# Altium project MSM8916_DRAM_PMIC_REF.PrjPcb (part 2 of 4)

## Sheet 10 MSM8916_POWER1.SchDoc
size 871 x 576 mm
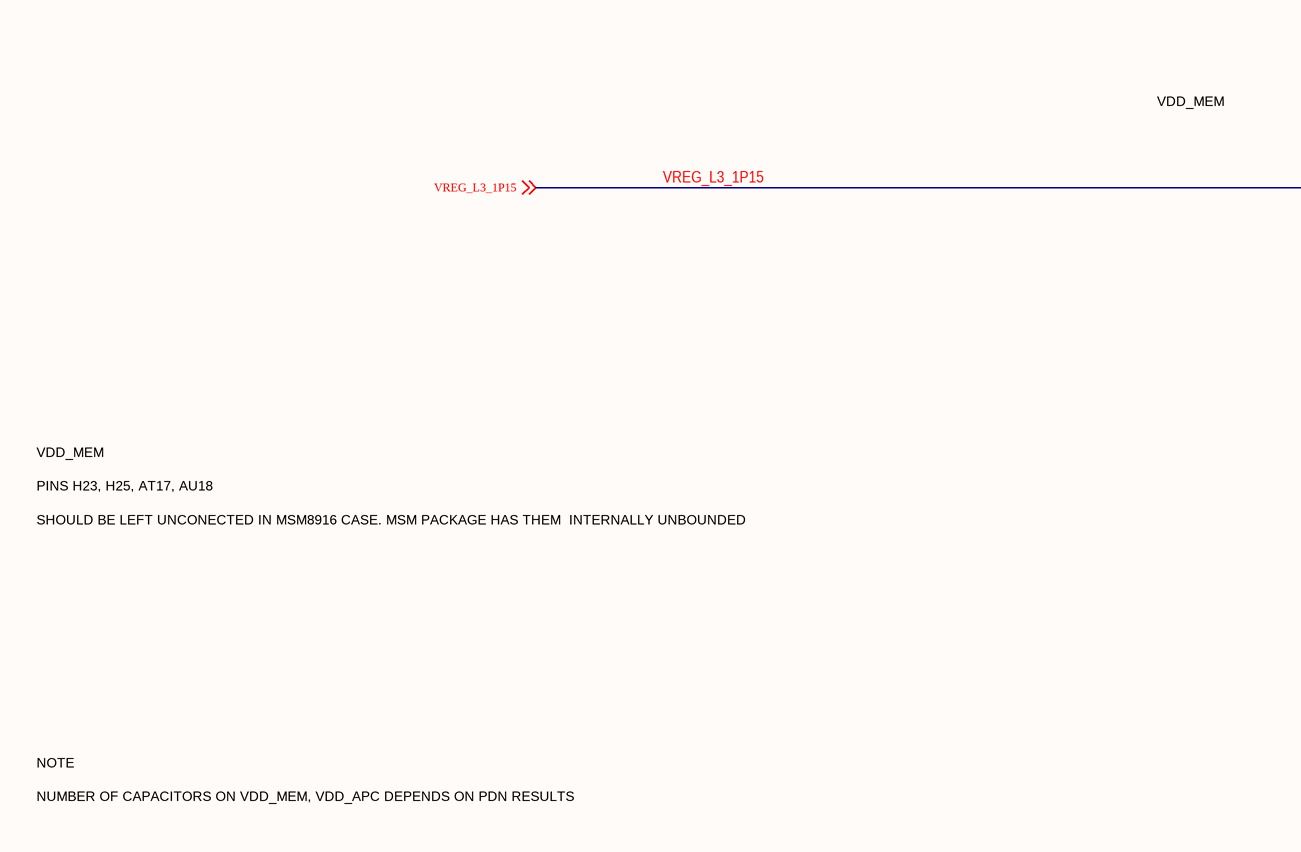
[diagram p21: 10 MSM8916_POWER1.SchDoc, top left]
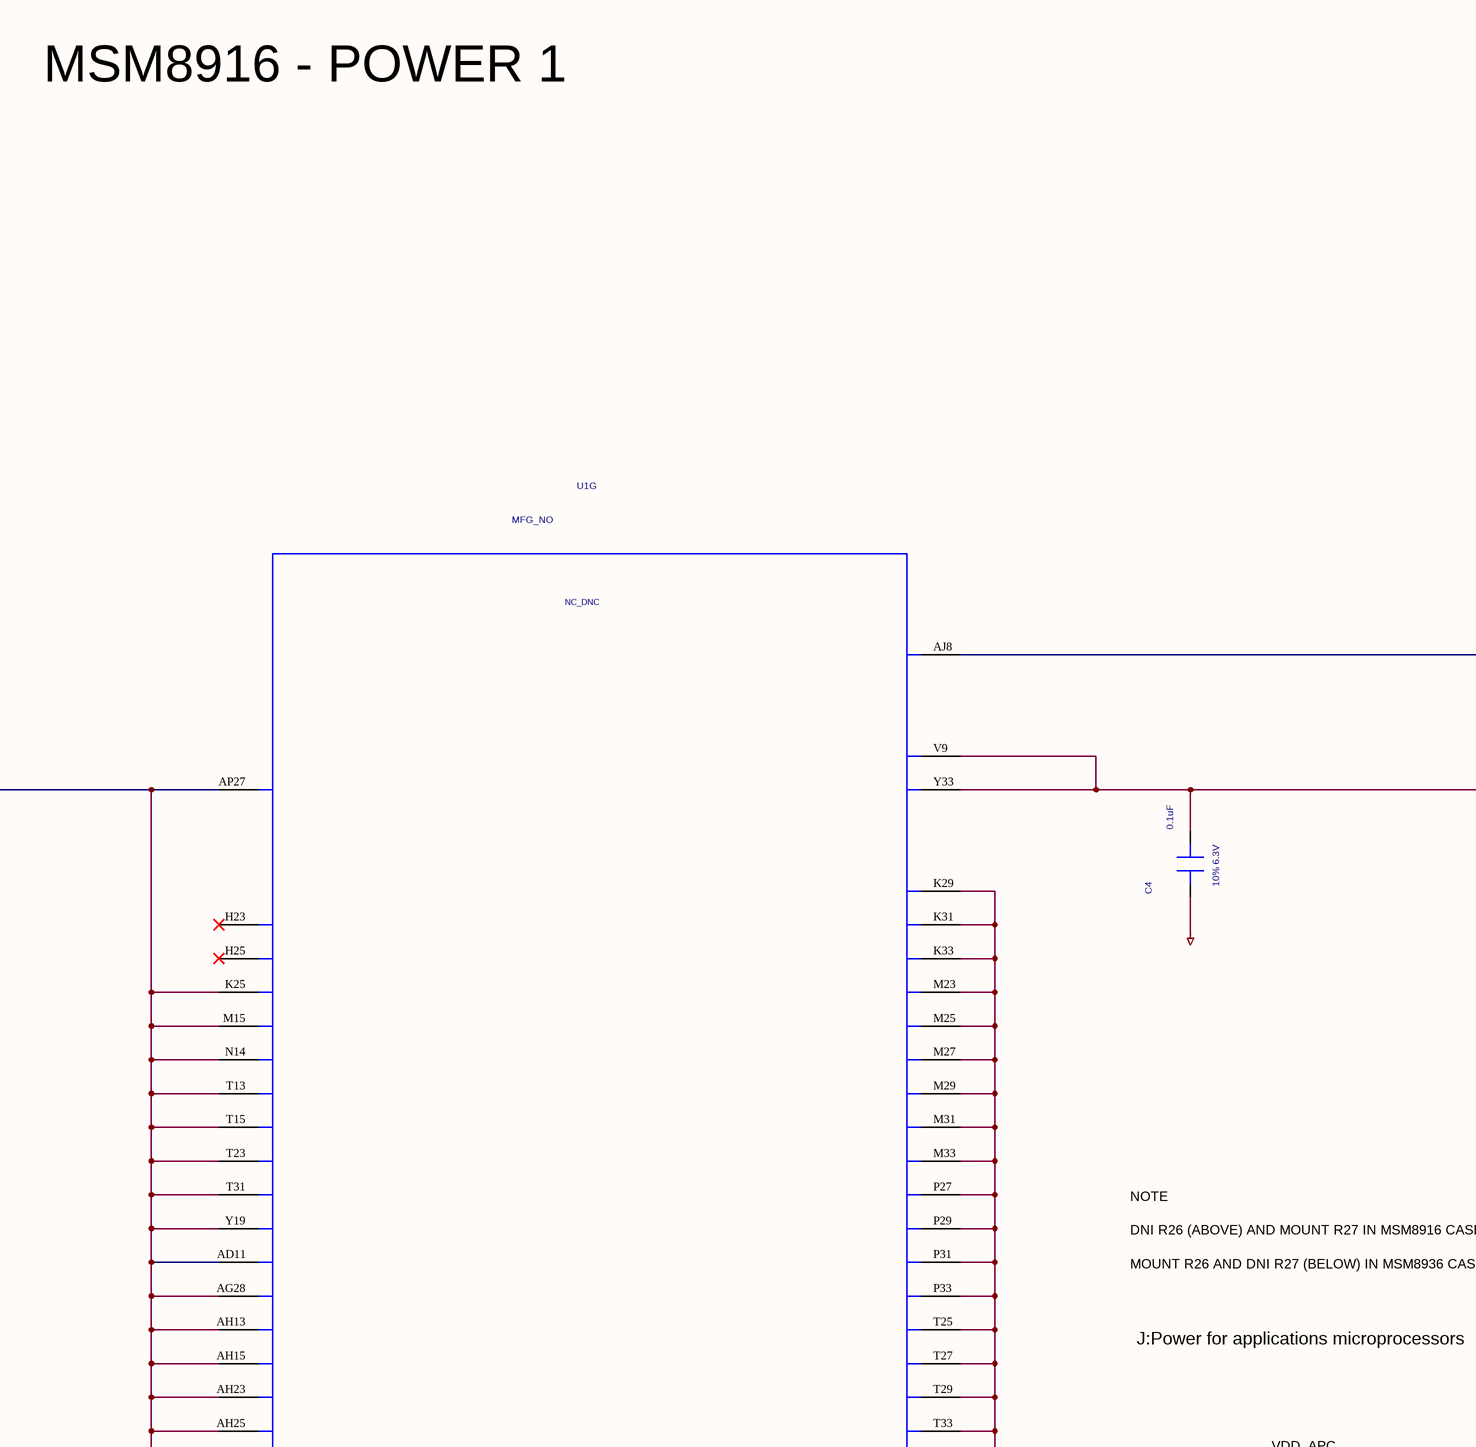
[diagram p22: 10 MSM8916_POWER1.SchDoc, top middle]
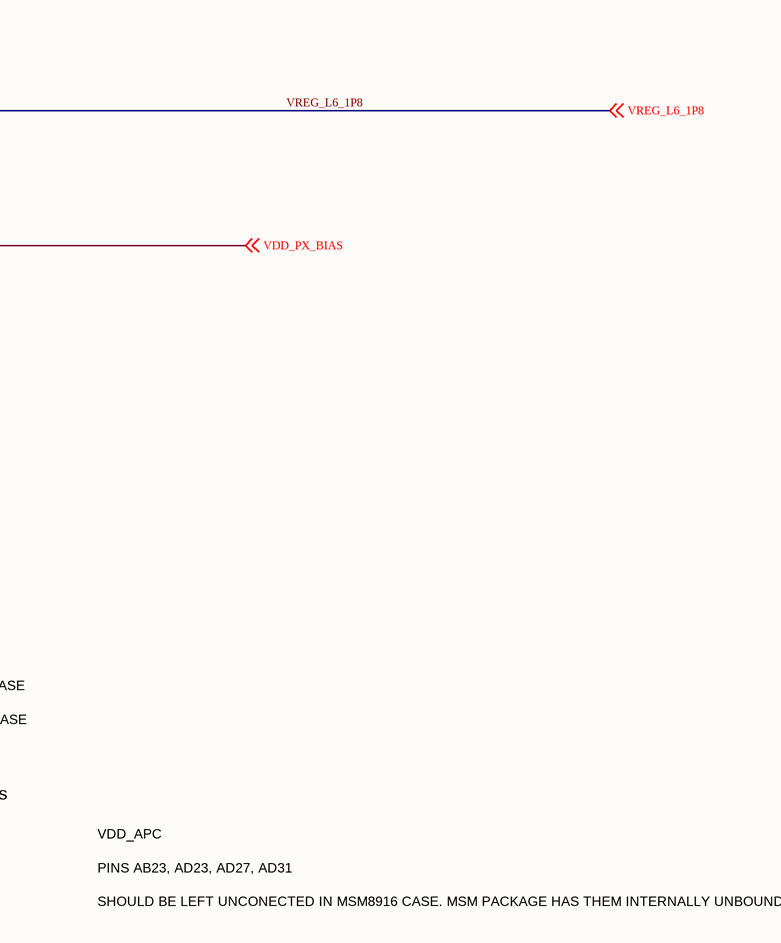
[diagram p23: 10 MSM8916_POWER1.SchDoc, top right]
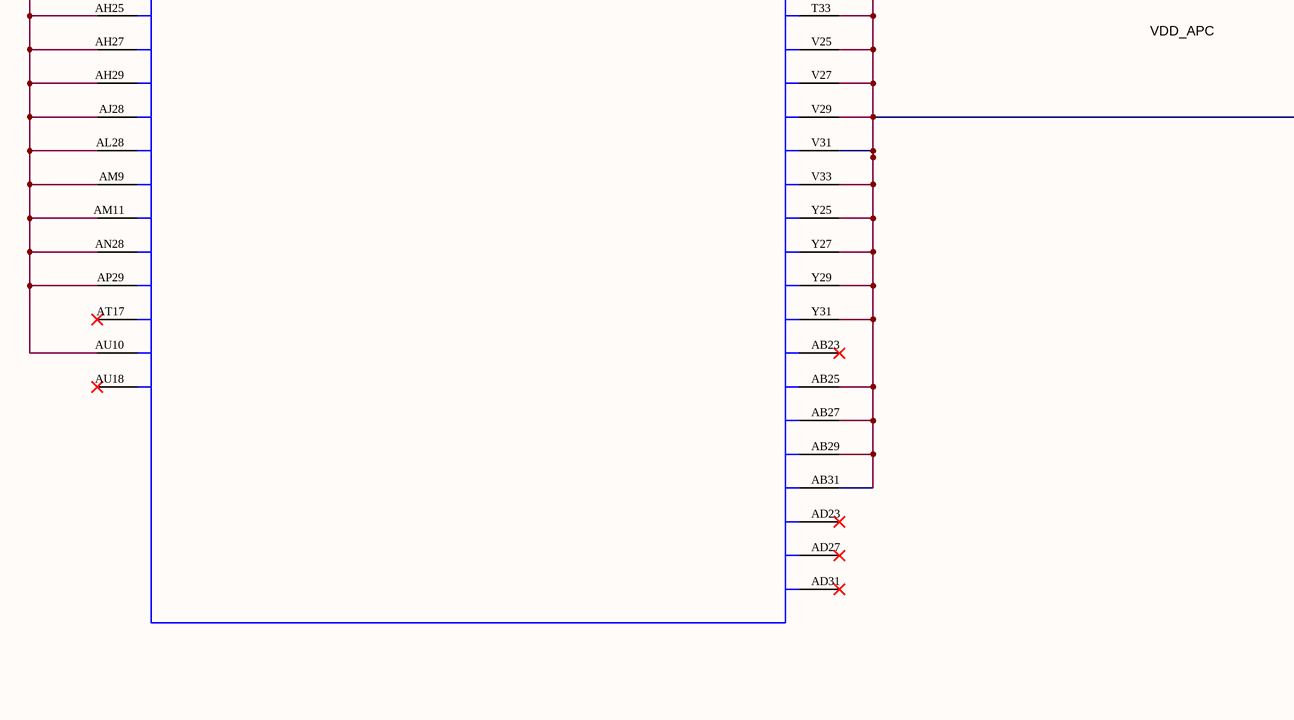
[diagram p24: 10 MSM8916_POWER1.SchDoc, bottom middle]
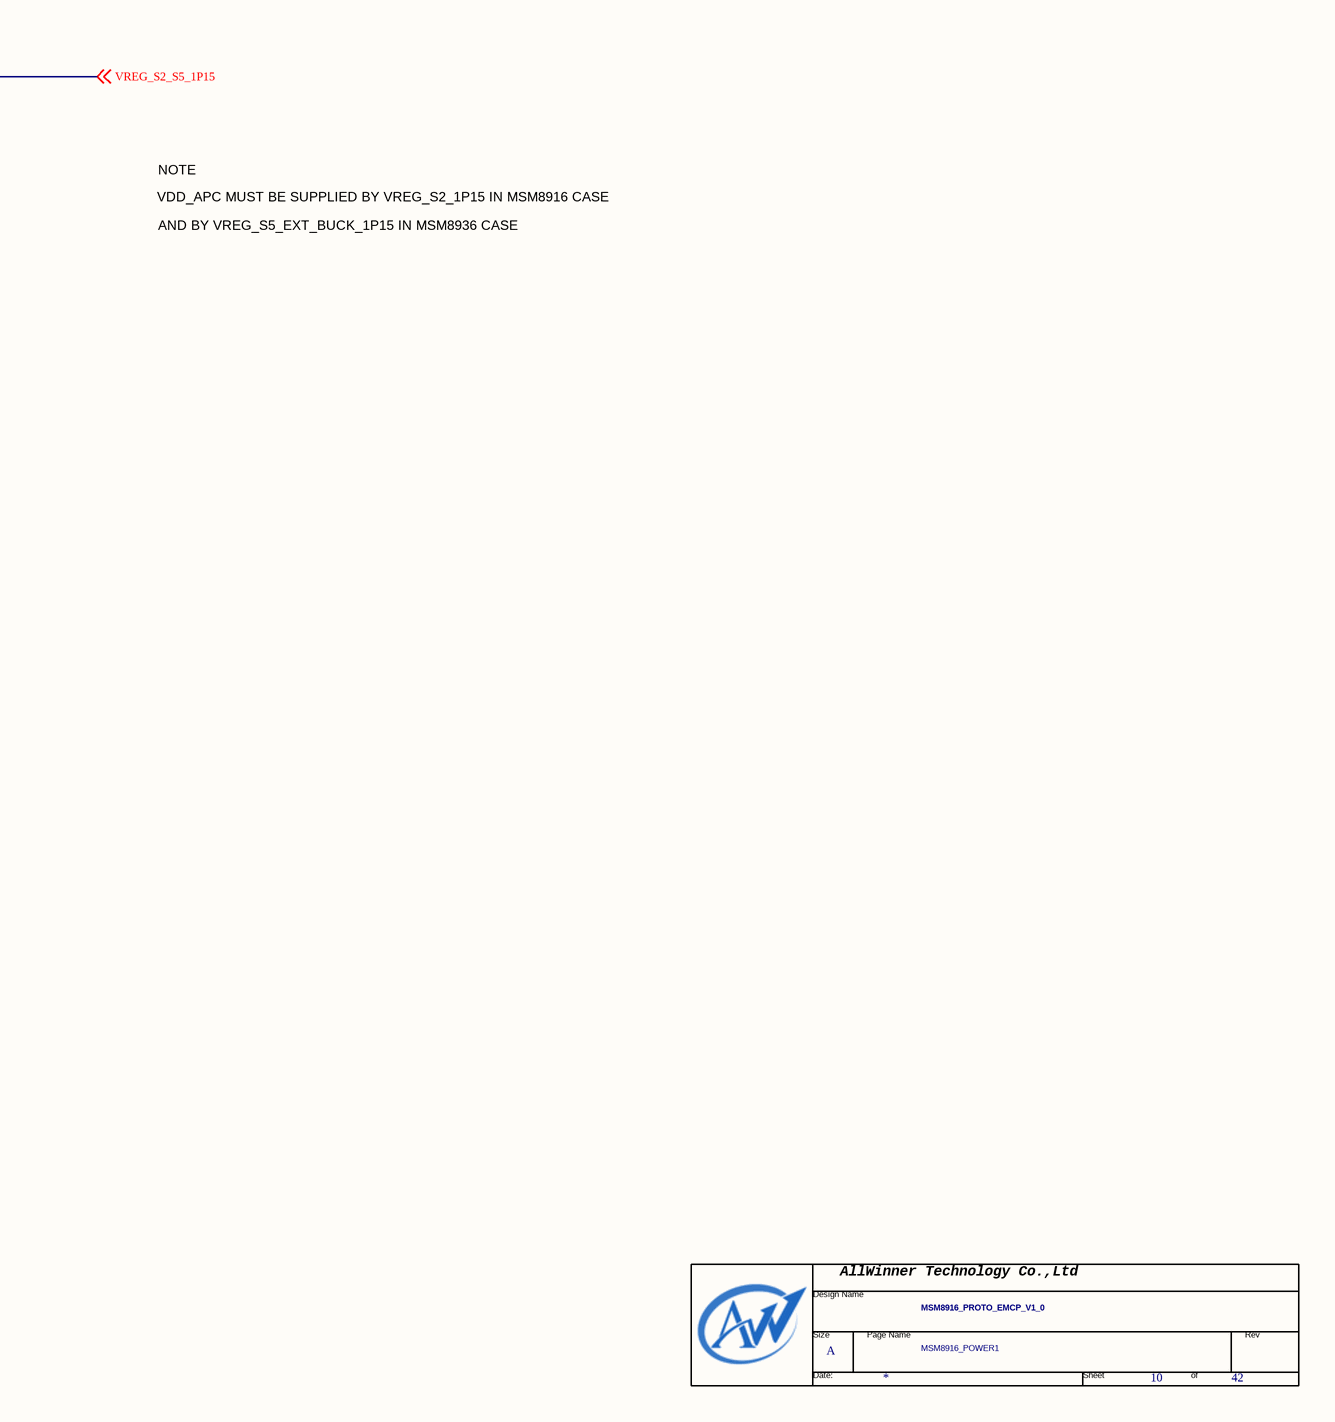
[diagram p25: 10 MSM8916_POWER1.SchDoc, bottom right]

### Parts
(Parts that share a designator on the sheet are numbered #1, #2 ... from top to bottom, then left to right.)
*#4  Page Count: 42  Page Number: 10  Page Size: A  Title: MSM8916_PROTO_EMCP_V1_0  Doc: MSM8916_POWER1  (hidden comment: TitleBlock0-AW)  (graphical)
C4  0.1uF  Tolerance: 10% 6.3V  [c0402]
U1  SYMNAME: NC_DNC  PART_ID: MFG_NO  [MSM-8916-0-760NSP-TR-00-0]  (hidden comment: ASIC_MSM8936_760PIN)  (part G of 13)

### Nets
DGND: C4.1(POS)
VREG_L6_1P8: U1.AJ8(QFPROM_BLOW_VDD) ; off-sheet VREG_L6_1P8
VDD_PX_BIAS: C4.2(NEG) U1.V9(VDDPX_VBIAS_SDC) U1.Y33(VDDPX_VBIAS_UIM) ; off-sheet VDD_PX_BIAS
VREG_L3_1P15: U1.AD11(VDDMX_1_11) U1.AG28(VDDMX_1_12) U1.AH13(VDDMX_1_13) U1.AH15(VDDMX_1_14) U1.AH23(VDDMX_1_15) U1.AH25(VDDMX_1_16) U1.AH27(VDDMX_1_17) U1.AH29(VDDMX_1_18) U1.AJ28(VDDMX_1_19) U1.AL28(VDDMX_1_20) U1.AM9(VDDMX_1_21) U1.AM11(VDDMX_1_22) U1.AN28(VDDMX_1_23) U1.AP27(VDDMX_TXDAC) U1.AP29(VDDMX_1_24) U1.AU10(VDDMX_1_26) U1.K25(VDDMX_1_3) U1.M15(VDDMX_1_4) U1.N14(VDDMX_1_5) U1.T13(VDDMX_1_6) U1.T15(VDDMX_1_7) U1.T23(VDDMX_1_8) U1.T31(VDDMX_1_9) U1.Y19(VDDMX_1_10) ; off-sheet VREG_L3_1P15
VREG_S2_S5_1P15: U1.AB25(VDD_APC_28) U1.AB27(VDD_APC_29) U1.AB29(VDD_APC_30) U1.AB31(VDD_APC_31) U1.K29(VDD_APC_1) U1.K31(VDD_APC_2) U1.K33(VDD_APC_3) U1.M23(VDD_APC_4) U1.M25(VDD_APC_5) U1.M27(VDD_APC_6) U1.M29(VDD_APC_7) U1.M31(VDD_APC_8) U1.M33(VDD_APC_9) U1.P27(VDD_APC_10) U1.P29(VDD_APC_11) U1.P31(VDD_APC_12) U1.P33(VDD_APC_13) U1.T25(VDD_APC_14) U1.T27(VDD_APC_15) U1.T29(VDD_APC_16) U1.T33(VDD_APC_17) U1.V25(VDD_APC_18) U1.V27(VDD_APC_19) U1.V29(VDD_APC_20) U1.V31(VDD_APC_21) U1.V33(VDD_APC_22) U1.Y25(VDD_APC_23) U1.Y27(VDD_APC_24) U1.Y29(VDD_APC_25) U1.Y31(VDD_APC_26) ; off-sheet VREG_S2_S5_1P15

Not connected (* = marked no-connect by the designer): U1 AB23(VDD_APC_27)* AD23(VDD_APC_32)* AD27(VDD_APC_33)* AD31(VDD_APC_34)* AT17(VDDMX_1_25)* AU18(VDDMX_1_27)* H23(VDDMX_1_1)* H25(VDDMX_1_2)*

### Notes on the sheet
- MSM8916 - POWER 1
- VDD_MEM
- SHOULD BE LEFT UNCONECTED IN MSM8916 CASE. MSM PACKAGE HAS THEM  INTERNALLY UNBOUNDED
- PINS H23, H25, AT17, AU18
- DNI R26 (ABOVE) AND MOUNT R27 IN MSM8916 CASE
- NOTE
- MOUNT R26 AND DNI R27 (BELOW) IN MSM8936 CASE
- J:Power for applications microprocessors
- VDD_APC
- NUMBER OF CAPACITORS ON VDD_MEM, VDD_APC DEPENDS ON PDN RESULTS
- SHOULD BE LEFT UNCONECTED IN MSM8916 CASE. MSM PACKAGE HAS THEM INTERNALLY UNBOUNDED
- PINS AB23, AD23, AD27, AD31
- VDD_APC MUST BE SUPPLIED BY VREG_S2_1P15 IN MSM8916 CASE
- AND BY VREG_S5_EXT_BUCK_1P15 IN MSM8936 CASE
- (in symbol TitleBlock0-AW) AllWinner Technology Co.,Ltd; Design Name; Size; Page Name; Rev; Date:; Sheet; of

### Library data of the parts
C4 = CAP#1: PART_NUMBER: MCN_NO; PART_ID: MFG_NO; OriginalSymbolOrigin: (-75,50); VOLT: ?V; SYMNAME: CAP; CDS_LMAN_SYM_OUTLINE: -25,50,25,-50; PACK_TYPE: ?
U1 = ASIC_MSM8936_760PIN: PART_NUMBER: MCN_NO; OriginalSymbolOrigin: (-1100,2500); SPLIT_INST: TRUE; CDS_LMAN_SYM_OUTLINE: -1050,2500,1050,-2500; CDS_LMAN_SPLIT_NUMBER: 1 of 13; PACK_TYPE: ?
*#4 = TitleBlock0-AW: RevCode: ?; Page Create Date: March  8, 1995; Page Modify Date: *

## Sheet 12 MSM8916_POWER3.SchDoc
size 871 x 579 mm
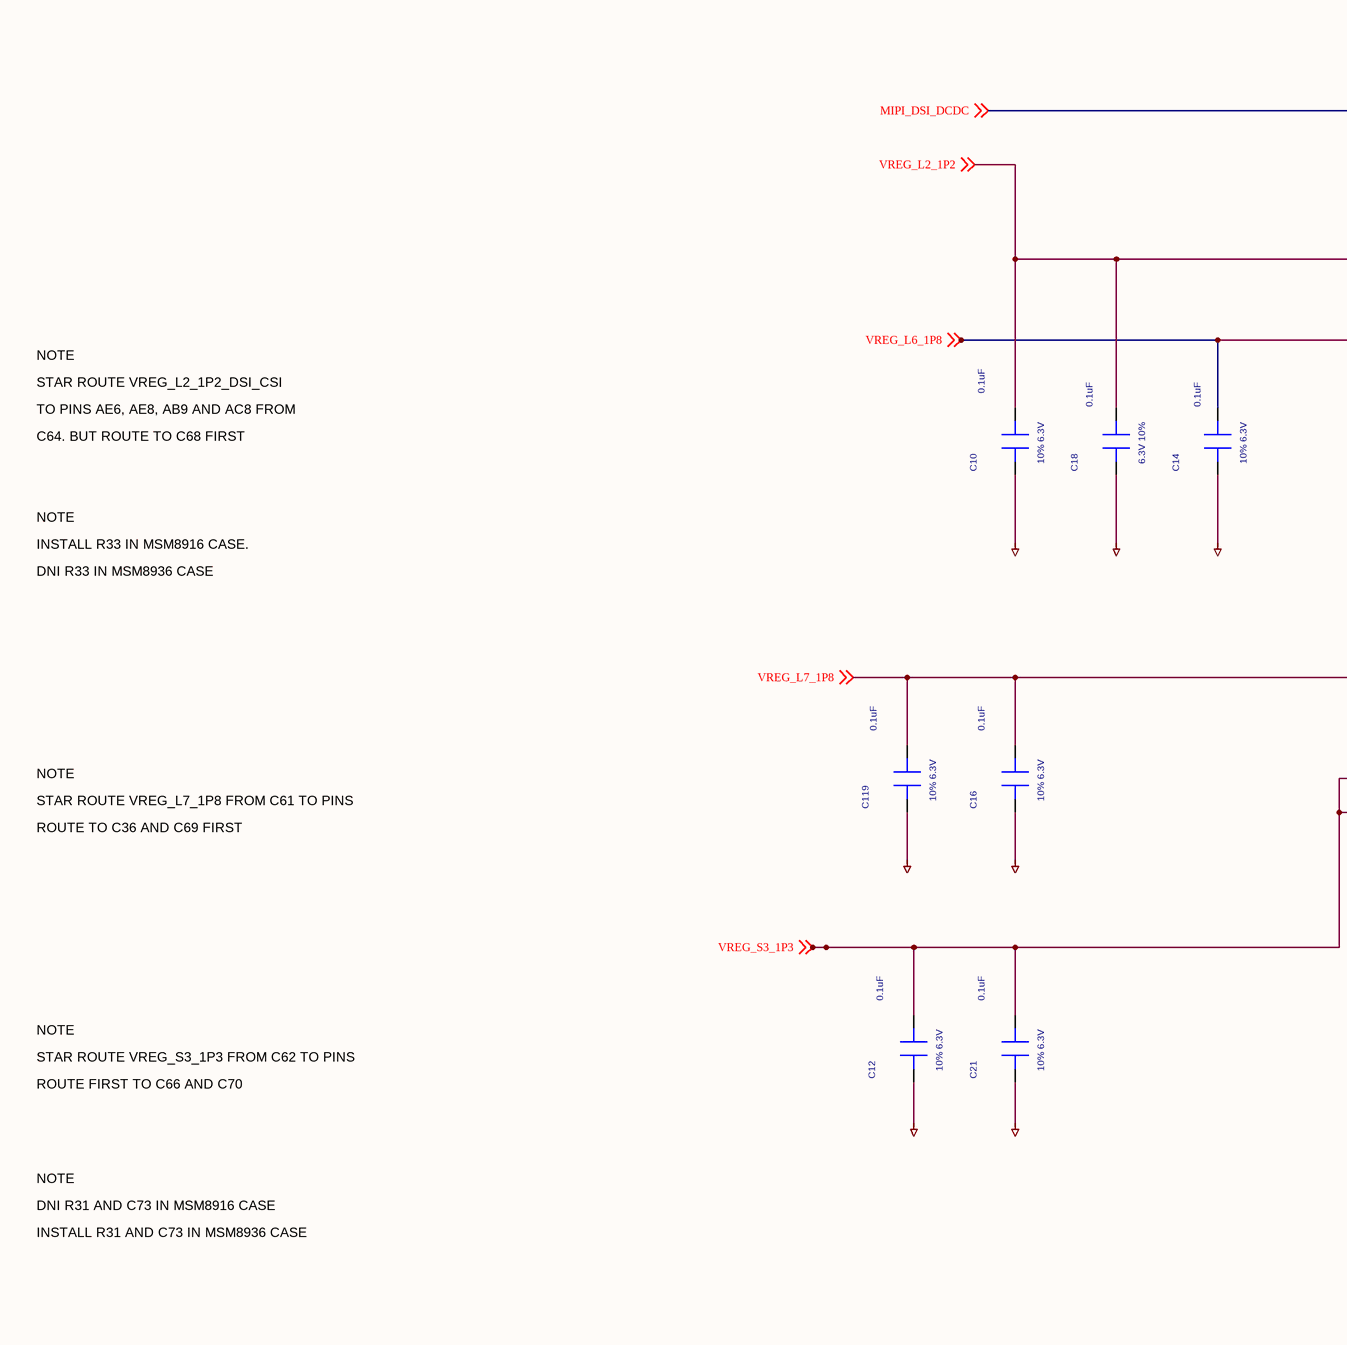
[diagram p26: 12 MSM8916_POWER3.SchDoc, top left]
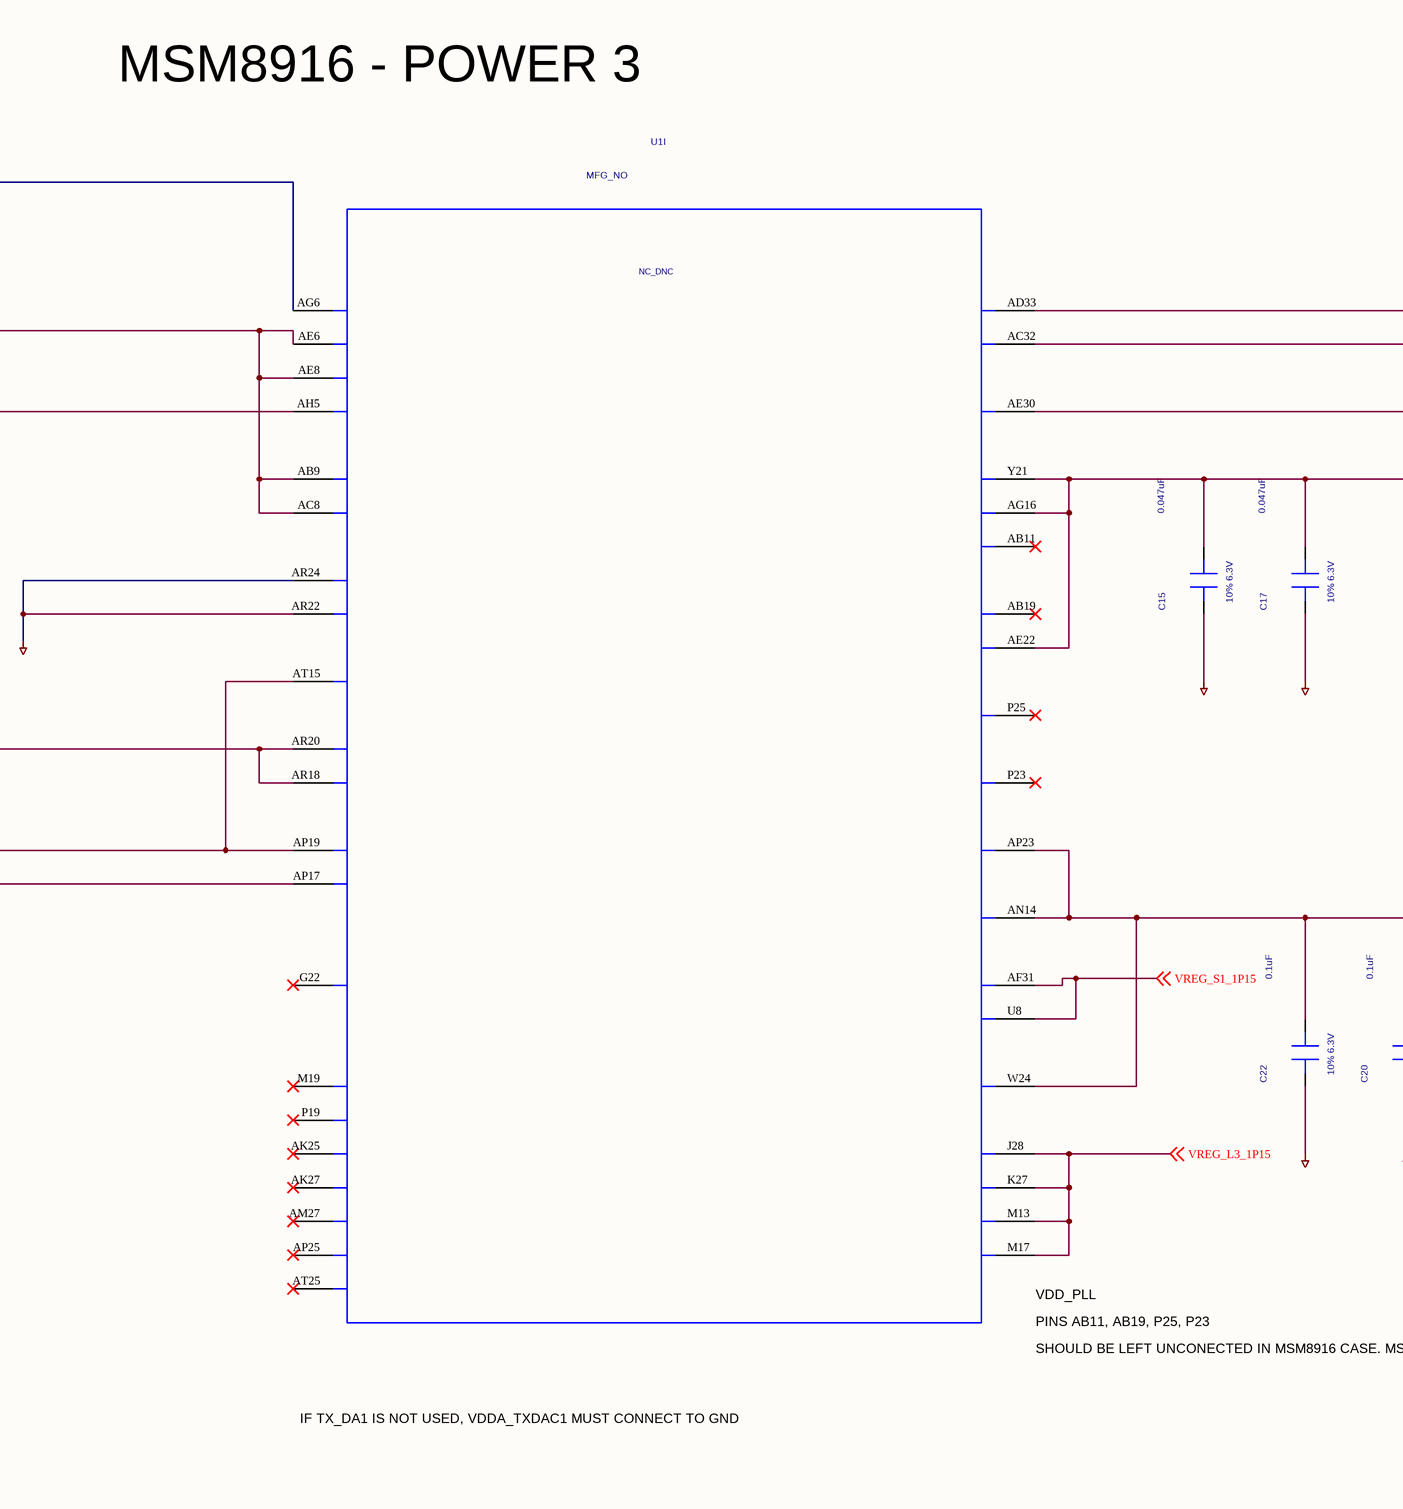
[diagram p27: 12 MSM8916_POWER3.SchDoc, top middle]
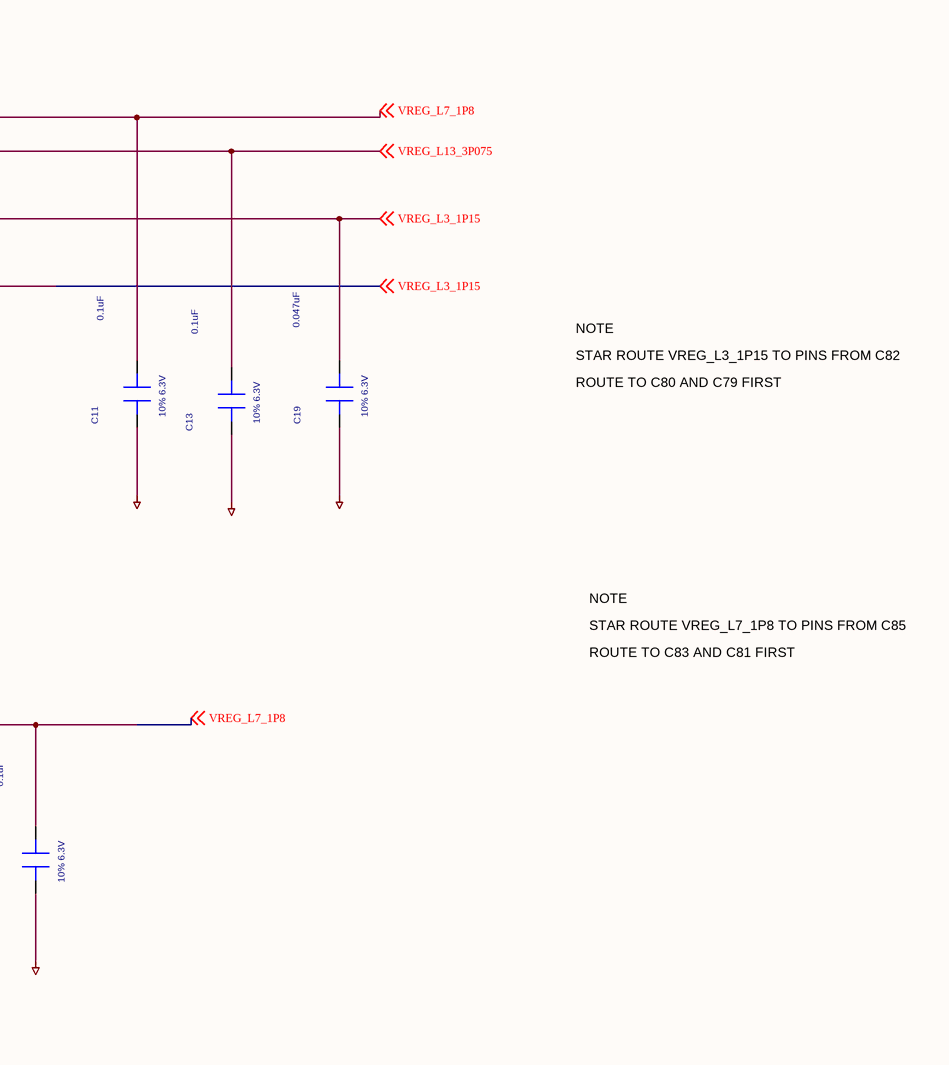
[diagram p28: 12 MSM8916_POWER3.SchDoc, top right]
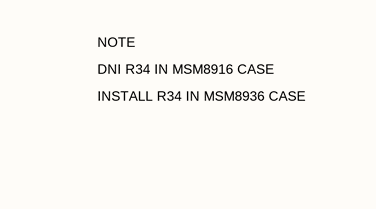
[diagram p29: 12 MSM8916_POWER3.SchDoc, bottom middle]
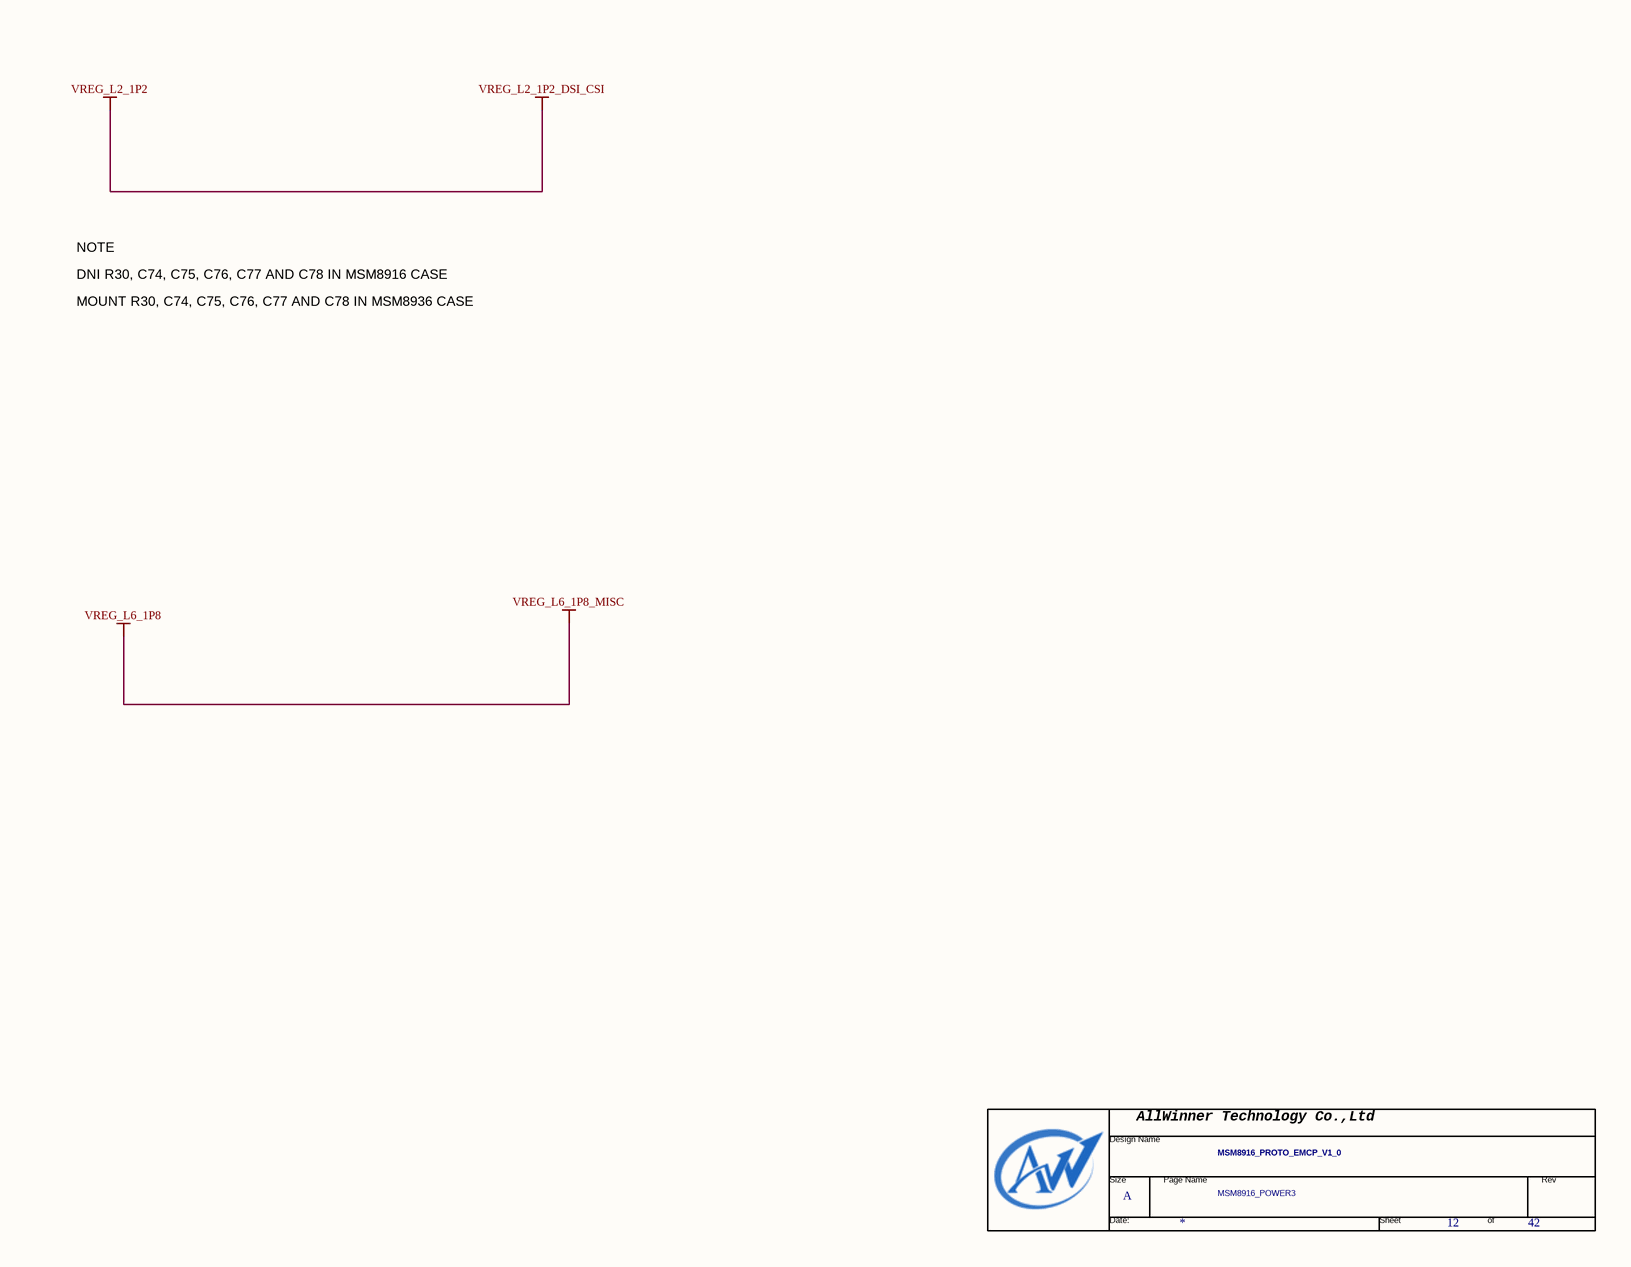
[diagram p30: 12 MSM8916_POWER3.SchDoc, bottom right]

### Parts
(Parts that share a designator on the sheet are numbered #1, #2 ... from top to bottom, then left to right.)
*#5  Page Count: 42  Page Number: 12  Page Size: A  Title: MSM8916_PROTO_EMCP_V1_0  Doc: MSM8916_POWER3  (hidden comment: TitleBlock0-AW)  (graphical)
C10  0.1uF  Tolerance: 10% 6.3V  [c0402]
C11  0.1uF  Tolerance: 10% 6.3V  [c0402]
C12  0.1uF  Tolerance: 10% 6.3V  [c0402]
C13  0.1uF  Tolerance: 10% 6.3V  [c0402]
C14  0.1uF  Tolerance: 10% 6.3V  [c0402]
C15  0.047uF  Tolerance: 10% 6.3V  [c0402]
C16  0.1uF  Tolerance: 10% 6.3V  [c0402]
C17  0.047uF  Tolerance: 10% 6.3V  [c0402]
C18  0.1uF  Tolerance: 6.3V 10%  [c0402]
C19  0.047uF  Tolerance: 10% 6.3V  [c0402]
C20  0.1uF  Tolerance: 10% 6.3V  [c0402]
C21  0.1uF  Tolerance: 10% 6.3V  [c0402]
C22  0.1uF  Tolerance: 10% 6.3V  [c0402]
C119  0.1uF  Tolerance: 10% 6.3V  [c0402]
U1  SYMNAME: NC_DNC  PART_ID: MFG_NO  [MSM-8916-0-760NSP-TR-00-0]  (hidden comment: ASIC_MSM8936_760PIN)  (part I of 13)

### Nets
DGND: C10.1(POS) C11.1(POS) C12.1(POS) C13.1(POS) C14.1(POS) C15.1(POS) C16.1(POS) C17.1(POS) C18.1(POS) C19.1(POS) C20.1(POS) C21.1(POS) C22.1(POS) C119.1(POS) U1.AR22(VDDA_TXDAC1) U1.AR24(VDDA_TXDAC0)
VREG_L2_1P2: C10.2(NEG) C18.2(NEG) U1.AB9(VDDA_MIPI_CSI_1) U1.AC8(VDDA_MIPI_CSI_2) U1.AE6(VDDA_1P2_MIPI_DSI_1) U1.AE8(VDDA_1P2_MIPI_DSI_2) ; off-sheet VREG_L2_1P2  [also labelled VREG_L2_1P2_DSI_CSI]
VREG_L6_1P8: C14.2(NEG) U1.AH5(VDDA_MIPI_DSI_PLL) ; off-sheet VREG_L6_1P8  [also labelled VREG_L6_1P8_MISC]
MIPI_DSI_DCDC: U1.AG6(VDDA_0P4_MIPI_DSI) ; off-sheet MIPI_DSI_DCDC
VREG_L3_1P15: C15.2(NEG) C17.2(NEG) C19.2(NEG) U1.AE22(VDD_SR_MPLL2_GPLL1) U1.AE30(USB2_HS_DVDD) U1.AG16(VDD_SR_GPLL3) U1.J28(VDDA_CDC_EBI0_CA_D0_D1_D2_D3_1) U1.K27(VDDA_CDC_EBI0_CA_D0_D1_D2_D3_2) U1.M13(VDDA_CDC_EBI0_CA_D0_D1_D2_D3_3) U1.M17(VDDA_CDC_EBI0_CA_D0_D1_D2_D3_4) U1.Y21(VDD_SR_GPLL0_GPLL2) ; off-sheet VREG_L3_1P15
VREG_L7_1P8: C11.2(NEG) C16.2(NEG) C20.2(NEG) C22.2(NEG) C119.2(NEG) U1.AD33(USB2_HS_VDDA_1P8) U1.AN14(VDD_SR2_PRONTO_PLL) U1.AP23(VDD_SR2_MODEM_PLL1) U1.AR18(VDDAH_BBRX_CH2) U1.AR20(VDDAH_BBRX_CH0_1) U1.W24(VDD_HF_APPS_PLL) ; off-sheet VREG_L7_1P8
VREG_L13_3P075: C13.2(NEG) U1.AC32(USB2_HS_VDDA_3P3) ; off-sheet VREG_L13_3P075
VREG_S1_1P15: U1.AF31(VDD_CDC_SDC1) U1.U8(VDD_CDC_SDC2) ; off-sheet VREG_S1_1P15
VREG_S3_1P3: C12.2(NEG) C21.2(NEG) U1.AP17(VDDAL_BBRX_CH2_GPSADC) U1.AP19(VDDAL_BBRX_CH0_1) U1.AT15(VDDA_WLAN) ; off-sheet VREG_S3_1P3  [project net VREG_S3]

Not connected (* = marked no-connect by the designer): U1 AB11(VDD_SR_GPLL4)* AB19(VDD_SR_MPLL0_GPLL6)* AK25(VDD_MSS_3)* AK27(VDD_MSS_4)* AM27(VDD_MSS_5)* AP25(VDD_MSS_6)* AT25(VDD_MSS_7)* G22(VDDA_PLL_1P8)* M19(VDD_MSS_1)* P19(VDD_MSS_2)* P23(VDD_SR2_BIMC_GPLL5)* P25(VDD_SR2_APPS_PLL)*

### Notes on the sheet
- MSM8916 - POWER 3
- TO PINS AE6, AE8, AB9 AND AC8 FROM
- STAR ROUTE VREG_L2_1P2_DSI_CSI
- NOTE
- C64. BUT ROUTE TO C68 FIRST
- STAR ROUTE VREG_L3_1P15 TO PINS FROM C82
- INSTALL R33 IN MSM8916 CASE.
- ROUTE TO C80 AND C79 FIRST
- DNI R33 IN MSM8936 CASE
- STAR ROUTE VREG_L7_1P8 TO PINS FROM C85
- STAR ROUTE VREG_L7_1P8 FROM C61 TO PINS
- ROUTE TO C83 AND C81 FIRST
- ROUTE TO C36 AND C69 FIRST
- STAR ROUTE VREG_S3_1P3 FROM C62 TO PINS
- ROUTE FIRST TO C66 AND C70
- DNI R31 AND C73 IN MSM8916 CASE
- (near U1) VDD_PLL
- INSTALL R31 AND C73 IN MSM8936 CASE
- SHOULD BE LEFT UNCONECTED IN MSM8916 CASE. MSM PACKAGE HAS THEM UNBOUNDED INTERNALLY
- (near U1) PINS AB11, AB19, P25, P23
- IF TX_DA1 IS NOT USED, VDDA_TXDAC1 MUST CONNECT TO GND
- DNI R34 IN MSM8916 CASE
- INSTALL R34 IN MSM8936 CASE
- MOUNT R30, C74, C75, C76, C77 AND C78 IN MSM8936 CASE
- DNI R30, C74, C75, C76, C77 AND C78 IN MSM8916 CASE
- (in symbol TitleBlock0-AW) AllWinner Technology Co.,Ltd; Design Name; Size; Page Name; Rev; Date:; Sheet; of

### Library data of the parts
C10-C22 C119 = CAP#1: as C4 on sheet 10 MSM8916_POWER1; PACK_TYPE: ?
U1 = ASIC_MSM8936_760PIN: as U1 on sheet 10 MSM8916_POWER1; PACK_TYPE: ?
*#5 = TitleBlock0-AW: RevCode: ?; Page Create Date: March  8, 1995; Page Modify Date: *

## Sheet 21 MEMORY_POWER.SchDoc
size 871 x 579 mm
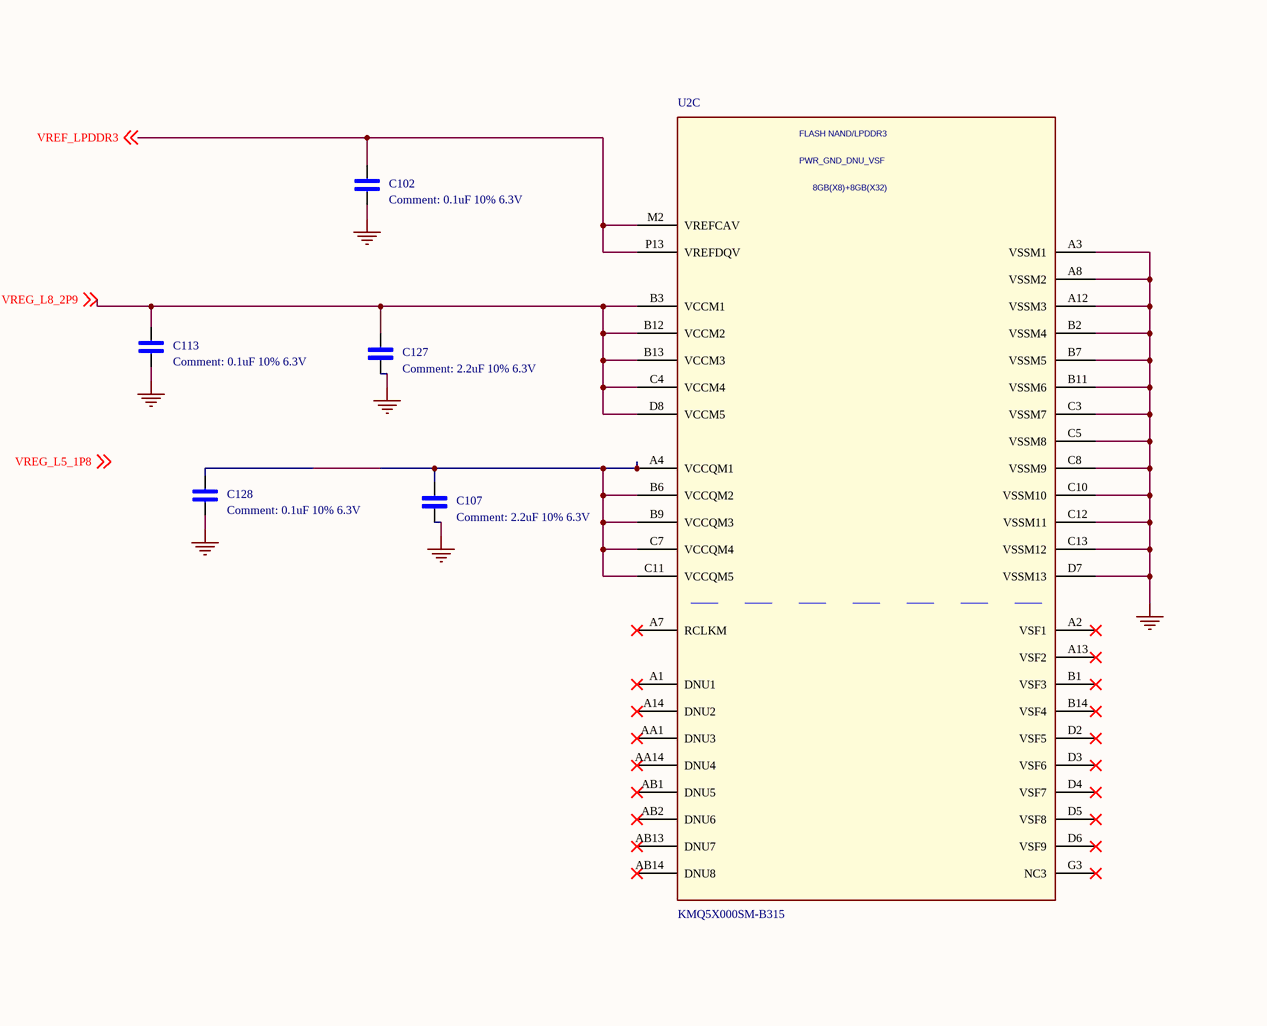
[diagram p31: 21 MEMORY_POWER.SchDoc, top left]
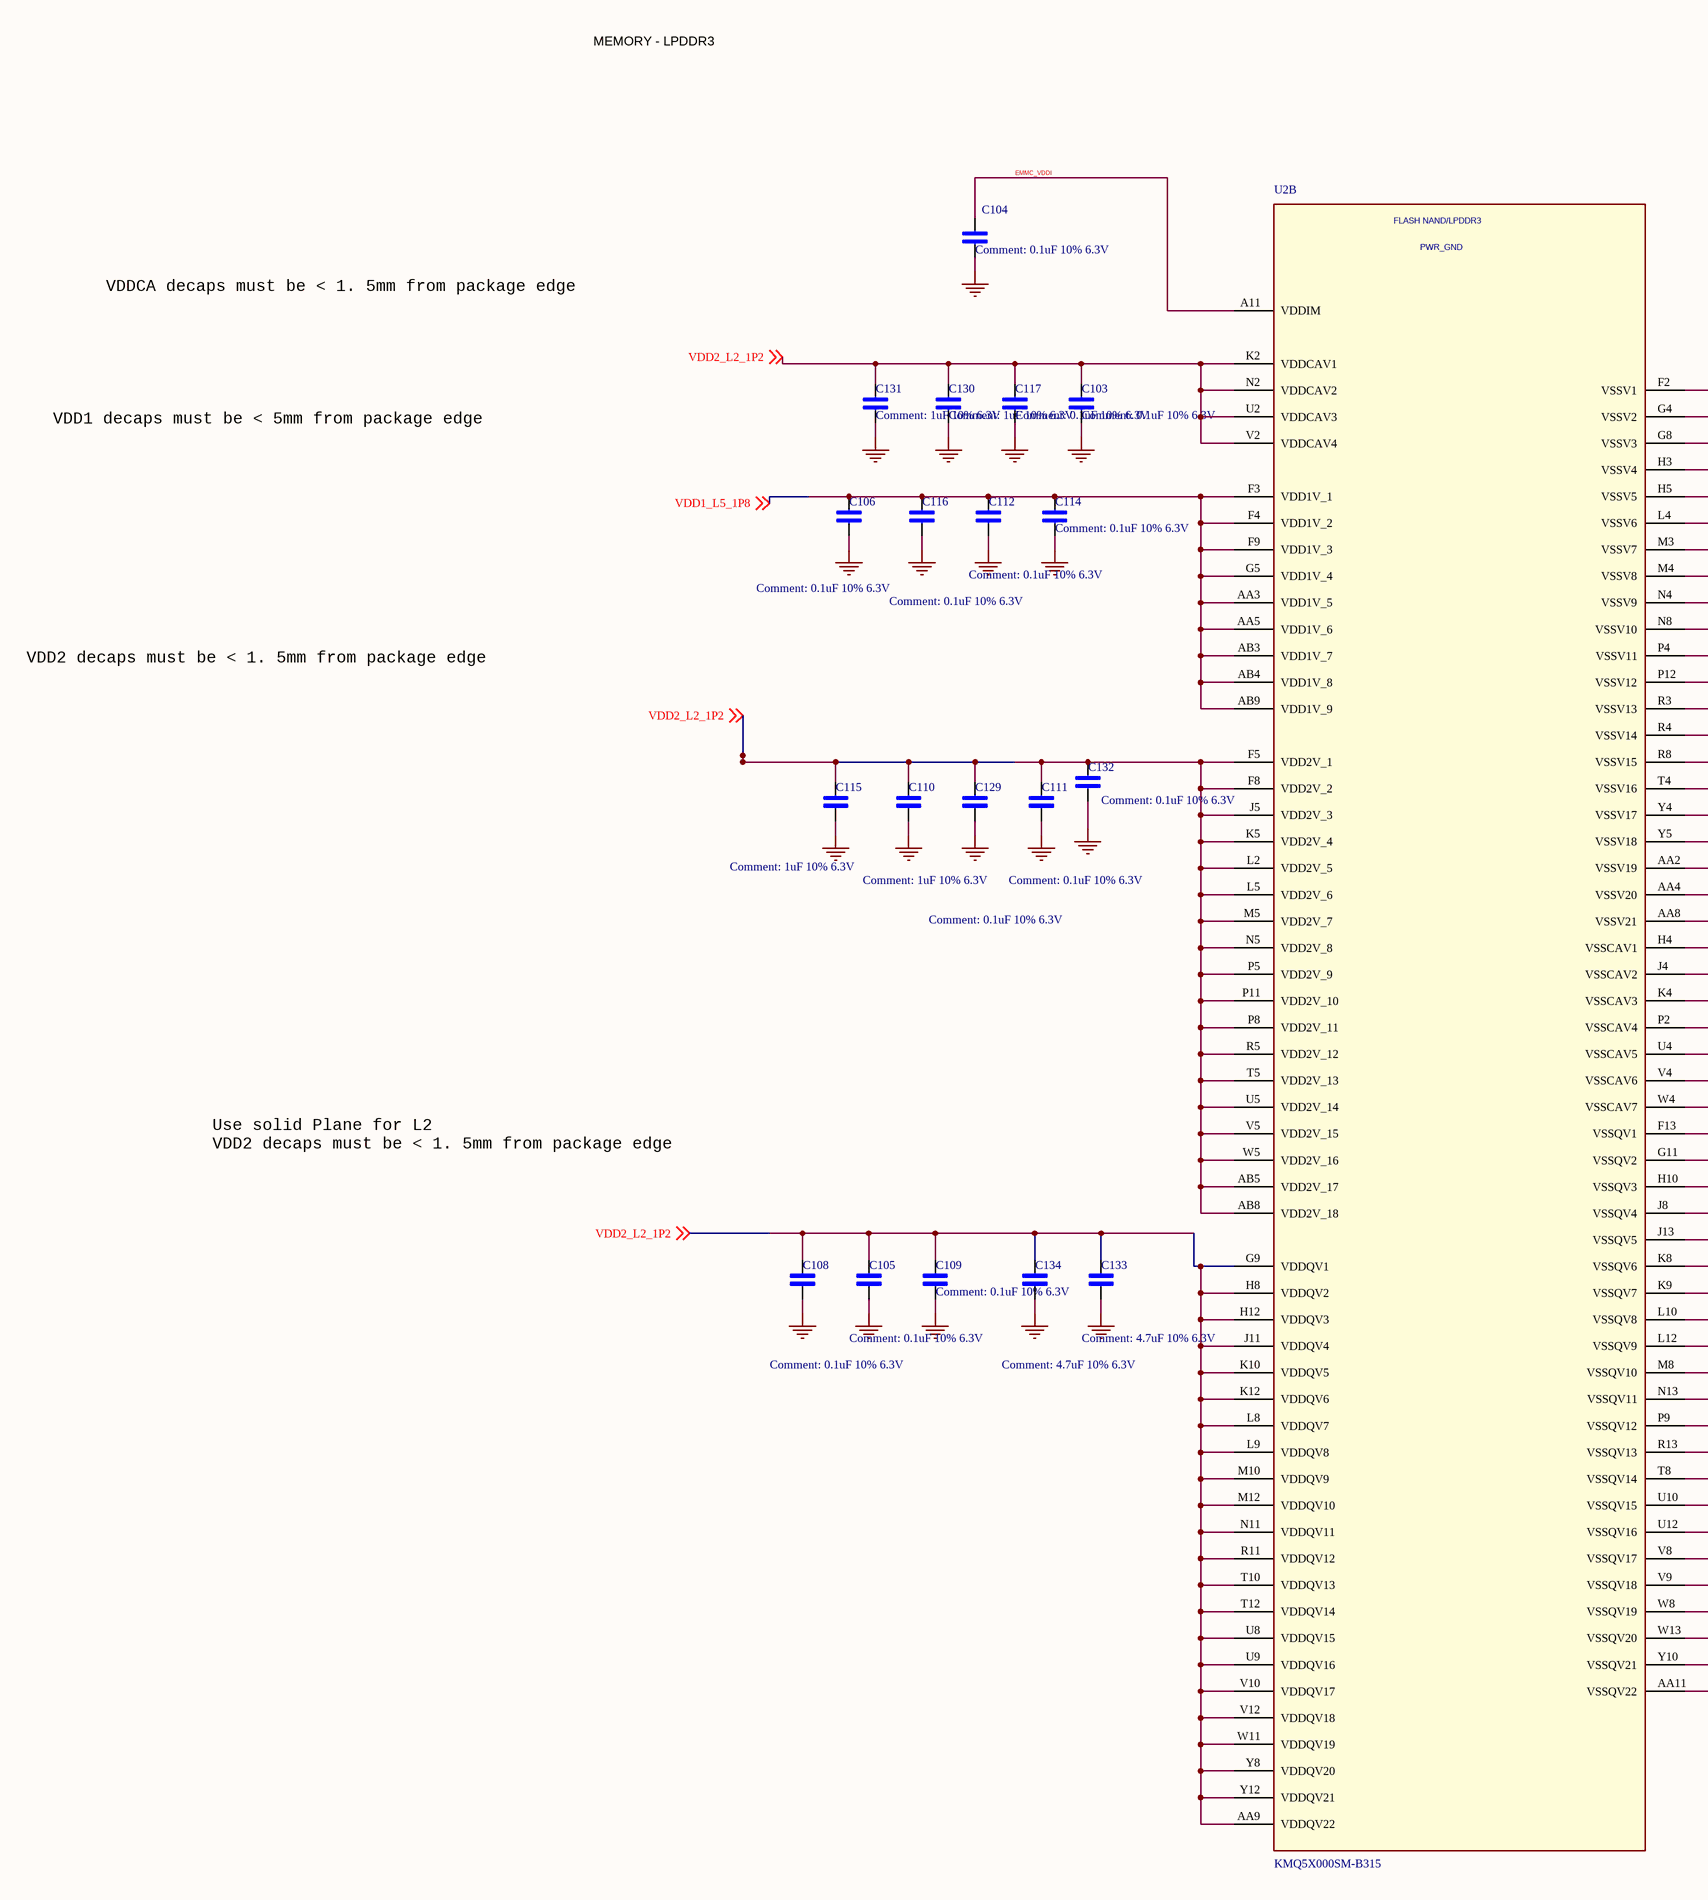
[diagram p32: 21 MEMORY_POWER.SchDoc, top middle]
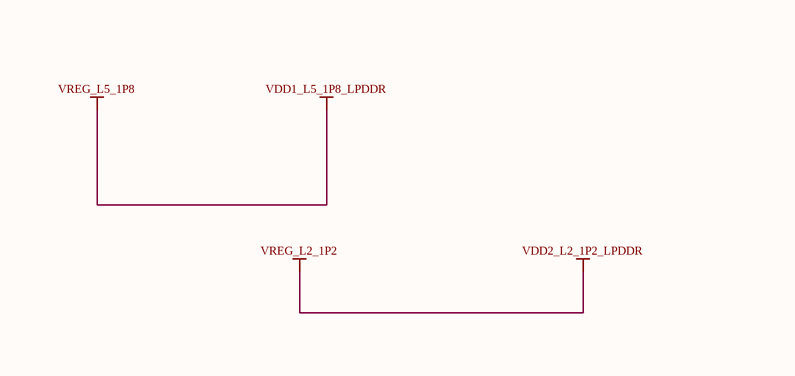
[diagram p33: 21 MEMORY_POWER.SchDoc, bottom left]
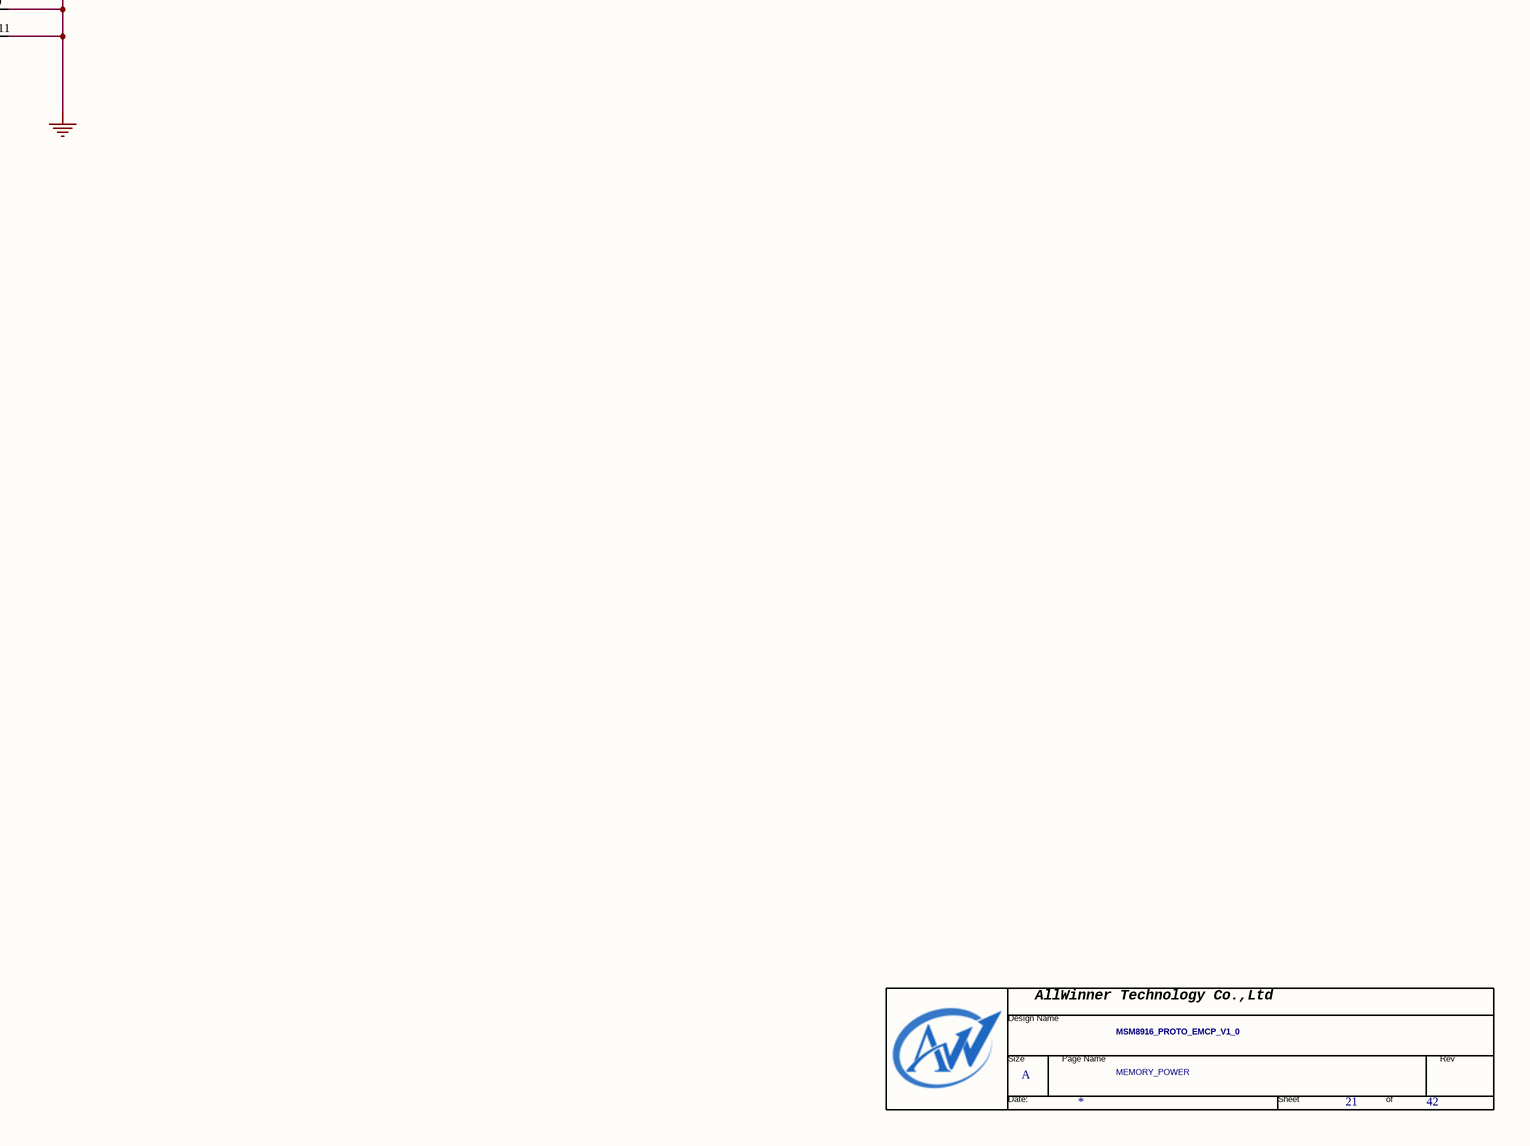
[diagram p34: 21 MEMORY_POWER.SchDoc, bottom right]

### Parts
(Parts that share a designator on the sheet are numbered #1, #2 ... from top to bottom, then left to right.)
*#6  Page Count: 42  Page Number: 21  Page Size: A  Title: MSM8916_PROTO_EMCP_V1_0  Doc: MEMORY_POWER  (hidden comment: TitleBlock0-AW)  (graphical)
C102  0.1uF 10% 6.3V  [c0402]
C103  0.1uF 10% 6.3V  [C0402]
C104  0.1uF 10% 6.3V  [c0402]
C105  0.1uF 10% 6.3V  [C0402]
C106  0.1uF 10% 6.3V  [C0402]
C107  2.2uF 10% 6.3V  [c0402]
C108  0.1uF 10% 6.3V  [C0402]
C109  0.1uF 10% 6.3V  [C0402]
C110  1uF 10% 6.3V  [C0402]
C111  0.1uF 10% 6.3V  [C0402]
C112  0.1uF 10% 6.3V  [C0402]
C113  0.1uF 10% 6.3V  [c0402]
C114  0.1uF 10% 6.3V  [C0402]
C115  1uF 10% 6.3V  [C0402]
C116  0.1uF 10% 6.3V  [C0402]
C117  0.1uF 10% 6.3V  [C0402]
C127  2.2uF 10% 6.3V  [c0402]
C128  0.1uF 10% 6.3V  [c0402]
C129  0.1uF 10% 6.3V  [C0402]
C130  1uF 10% 6.3V  [C0402]
C131  1uF 10% 6.3V  [C0402]
C132  0.1uF 10% 6.3V  [C0402]
C133  4.7uF 10% 6.3V  [C0402]
C134  4.7uF 10% 6.3V  [C0402]
U2  KMQ5X000SM-B315  [KMQ5X000SM-B315]  (parts B,C of 3)

### Nets
GND: C102.2(PIN2) C103.2(PIN2) C104.2(PIN2) C105.2(PIN2) C106.2(PIN2) C107.2(PIN2) C108.2(PIN2) C109.2(PIN2) C110.2(PIN2) C111.2(PIN2) C112.2(PIN2) C113.2(PIN2) C114.2(PIN2) C115.2(PIN2) C116.2(PIN2) C117.2(PIN2) C127.2(PIN2) C128.2(PIN2) C129.2(PIN2) C130.2(PIN2) C131.2(PIN2) C132.2(PIN2) C133.2(PIN2) C134.2(PIN2) U2.A3(VSSM1) U2.A8(VSSM2) U2.A12(VSSM3) U2.AA2(VSSV19) U2.AA4(VSSV20) U2.AA8(VSSV21) U2.AA11(VSSQV22) U2.B2(VSSM4) U2.B7(VSSM5) U2.B11(VSSM6) U2.C3(VSSM7) U2.C5(VSSM8) U2.C8(VSSM9) U2.C10(VSSM10) U2.C12(VSSM11) U2.C13(VSSM12) U2.D7(VSSM13) U2.F2(VSSV1) U2.F13(VSSQV1) U2.G4(VSSV2) U2.G8(VSSV3) U2.G11(VSSQV2) U2.H3(VSSV4) U2.H4(VSSCAV1) U2.H5(VSSV5) U2.H10(VSSQV3) U2.J4(VSSCAV2) U2.J8(VSSQV4) U2.J13(VSSQV5) U2.K4(VSSCAV3) U2.K8(VSSQV6) U2.K9(VSSQV7) U2.L4(VSSV6) U2.L10(VSSQV8) U2.L12(VSSQV9) U2.M3(VSSV7) U2.M4(VSSV8) U2.M8(VSSQV10) U2.N4(VSSV9) U2.N8(VSSV10) U2.N13(VSSQV11) U2.P2(VSSCAV4) U2.P4(VSSV11) U2.P9(VSSQV12) U2.P12(VSSV12) U2.R3(VSSV13) U2.R4(VSSV14) U2.R8(VSSV15) U2.R13(VSSQV13) U2.T4(VSSV16) U2.T8(VSSQV14) U2.U4(VSSCAV5) U2.U10(VSSQV15) U2.U12(VSSQV16) U2.V4(VSSCAV6) U2.V8(VSSQV17) U2.V9(VSSQV18) U2.W4(VSSCAV7) U2.W8(VSSQV19) U2.W13(VSSQV20) U2.Y4(VSSV17) U2.Y5(VSSV18) U2.Y10(VSSQV21)
EMMC_VDDI: C104.1(PIN1) U2.A11(VDDIM)
VDD1_L5_1P8: C106.1(PIN1) C112.1(PIN1) C114.1(PIN1) C116.1(PIN1) U2.AA3(VDD1V_5) U2.AA5(VDD1V_6) U2.AB3(VDD1V_7) U2.AB4(VDD1V_8) U2.AB9(VDD1V_9) U2.F3(VDD1V_1) U2.F4(VDD1V_2) U2.F9(VDD1V_3) U2.G5(VDD1V_4) ; off-sheet VDD1_L5_1P8
VDD2_L2_1P2: C103.1(PIN1) C105.1(PIN1) C108.1(PIN1) C109.1(PIN1) C110.1(PIN1) C111.1(PIN1) C115.1(PIN1) C117.1(PIN1) C129.1(PIN1) C130.1(PIN1) C131.1(PIN1) C132.1(PIN1) C133.1(PIN1) C134.1(PIN1) U2.AA9(VDDQV22) U2.AB5(VDD2V_17) U2.AB8(VDD2V_18) U2.F5(VDD2V_1) U2.F8(VDD2V_2) U2.G9(VDDQV1) U2.H8(VDDQV2) U2.H12(VDDQV3) U2.J5(VDD2V_3) U2.J11(VDDQV4) U2.K2(VDDCAV1) U2.K5(VDD2V_4) U2.K10(VDDQV5) U2.K12(VDDQV6) U2.L2(VDD2V_5) U2.L5(VDD2V_6) U2.L8(VDDQV7) U2.L9(VDDQV8) U2.M5(VDD2V_7) U2.M10(VDDQV9) U2.M12(VDDQV10) U2.N2(VDDCAV2) U2.N5(VDD2V_8) U2.N11(VDDQV11) U2.P5(VDD2V_9) U2.P8(VDD2V_11) U2.P11(VDD2V_10) U2.R5(VDD2V_12) U2.R11(VDDQV12) U2.T5(VDD2V_13) U2.T10(VDDQV13) U2.T12(VDDQV14) U2.U2(VDDCAV3) U2.U5(VDD2V_14) U2.U8(VDDQV15) U2.U9(VDDQV16) U2.V2(VDDCAV4) U2.V5(VDD2V_15) U2.V10(VDDQV17) U2.V12(VDDQV18) U2.W5(VDD2V_16) U2.W11(VDDQV19) U2.Y8(VDDQV20) U2.Y12(VDDQV21) ; off-sheet VDD2_L2_1P2
VREF_LPDDR3: C102.1(PIN1) U2.M2(VREFCAV) U2.P13(VREFDQV) ; off-sheet VREF_LPDDR3  [project net EBIO_VREF]
VREG_L8_2P9: C113.1(PIN1) C127.1(PIN1) U2.B3(VCCM1) U2.B12(VCCM2) U2.B13(VCCM3) U2.C4(VCCM4) U2.D8(VCCM5) ; off-sheet VREG_L8_2P9
NetC107_1: C107.1(PIN1) C128.1(PIN1) U2.A4(VCCQM1) U2.B6(VCCQM2) U2.B9(VCCQM3) U2.C7(VCCQM4) U2.C11(VCCQM5)

Not connected (* = marked no-connect by the designer): U2 A1(DNU1)* A2(VSF1)* A7(RCLKM)* A13(VSF2)* A14(DNU2)* AA1(DNU3)* AA14(DNU4)* AB1(DNU5)* AB2(DNU6)* AB13(DNU7)* AB14(DNU8)* B1(VSF3)* B14(VSF4)* D2(VSF5)* D3(VSF6)* D4(VSF7)* D5(VSF8)* D6(VSF9)* G3(NC3)*

### Notes on the sheet
- MEMORY - LPDDR3
- VDDCA decaps must be < 1. 5mm from package edge
- VDD1 decaps must be < 5mm from package edge
- VDD2 decaps must be < 1. 5mm from package edge
- Use solid Plane for L2
  VDD2 decaps must be < 1. 5mm from package edge
- Labels drawn without touching a wire or pin: VREG_L5_1P8
- (in symbol KMQ5X000SM-B315, part B) FLASH NAND/LPDDR3; PWR_GND
- (in symbol KMQ5X000SM-B315, part C) FLASH NAND/LPDDR3; PWR_GND_DNU_VSF; 8GB(X8)+8GB(X32)
- (in symbol TitleBlock0-AW) AllWinner Technology Co.,Ltd; Design Name; Size; Page Name; Rev; Date:; Sheet; of

### Library data of the parts
C102 C104 C107 C113 C127 C128 = C0201
C103 C105 C106 C108-C112 C114-C117 C129-C134 = C0402
*#6 = TitleBlock0-AW: RevCode: ?; Page Create Date: March  8, 1995; Page Modify Date: *

## Sheet 14 PM8916_CONTROL CLOCK.SchDoc
size 871 x 576 mm
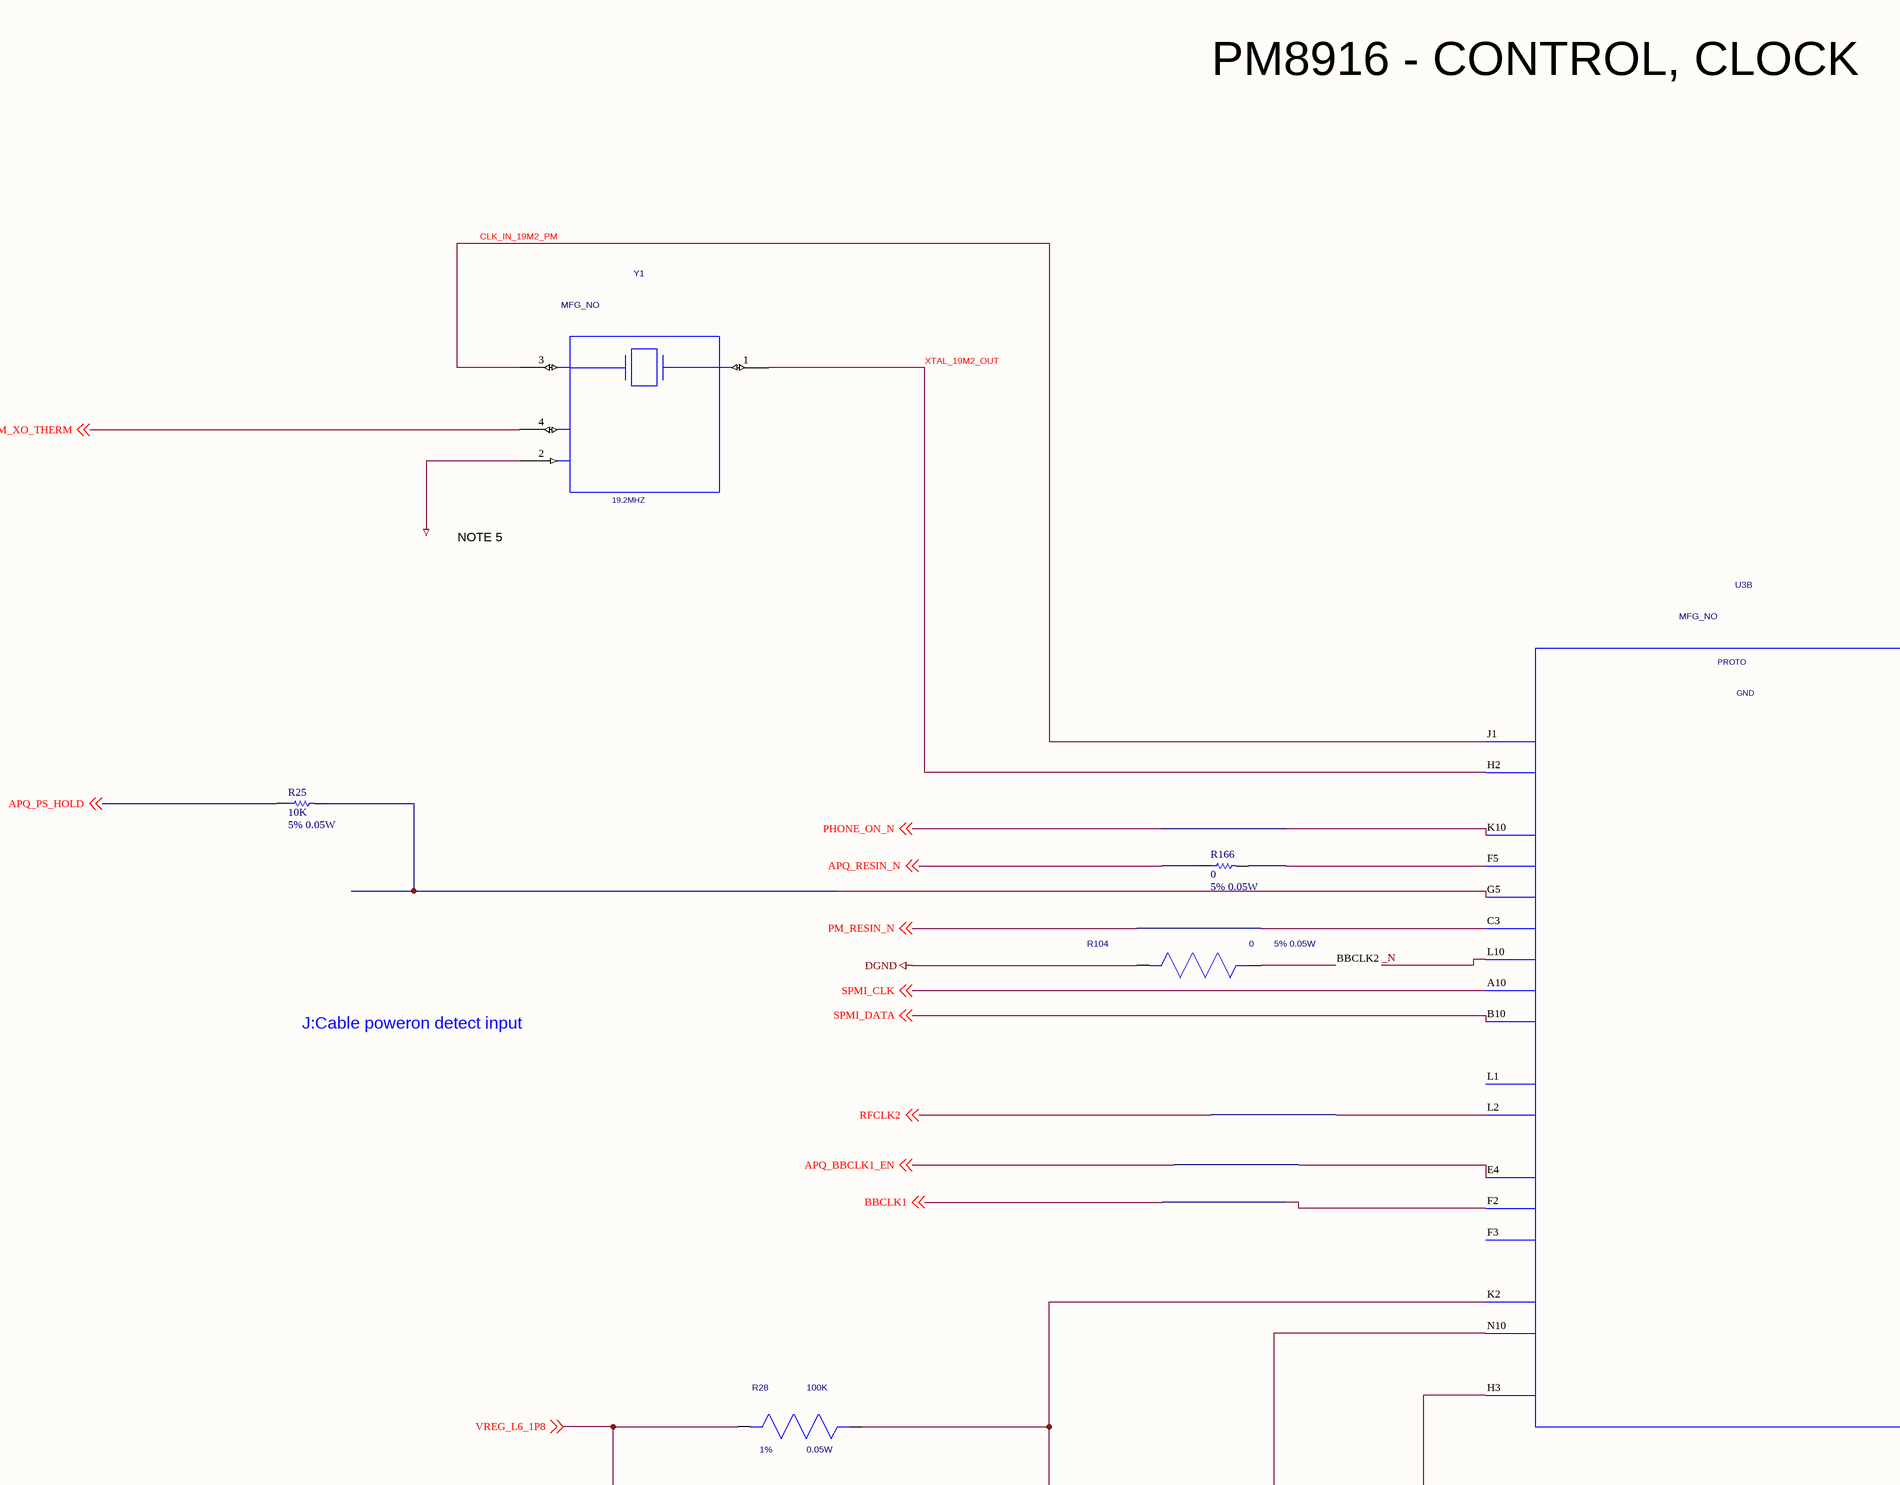
[diagram p35: 14 PM8916_CONTROL CLOCK.SchDoc, top left]
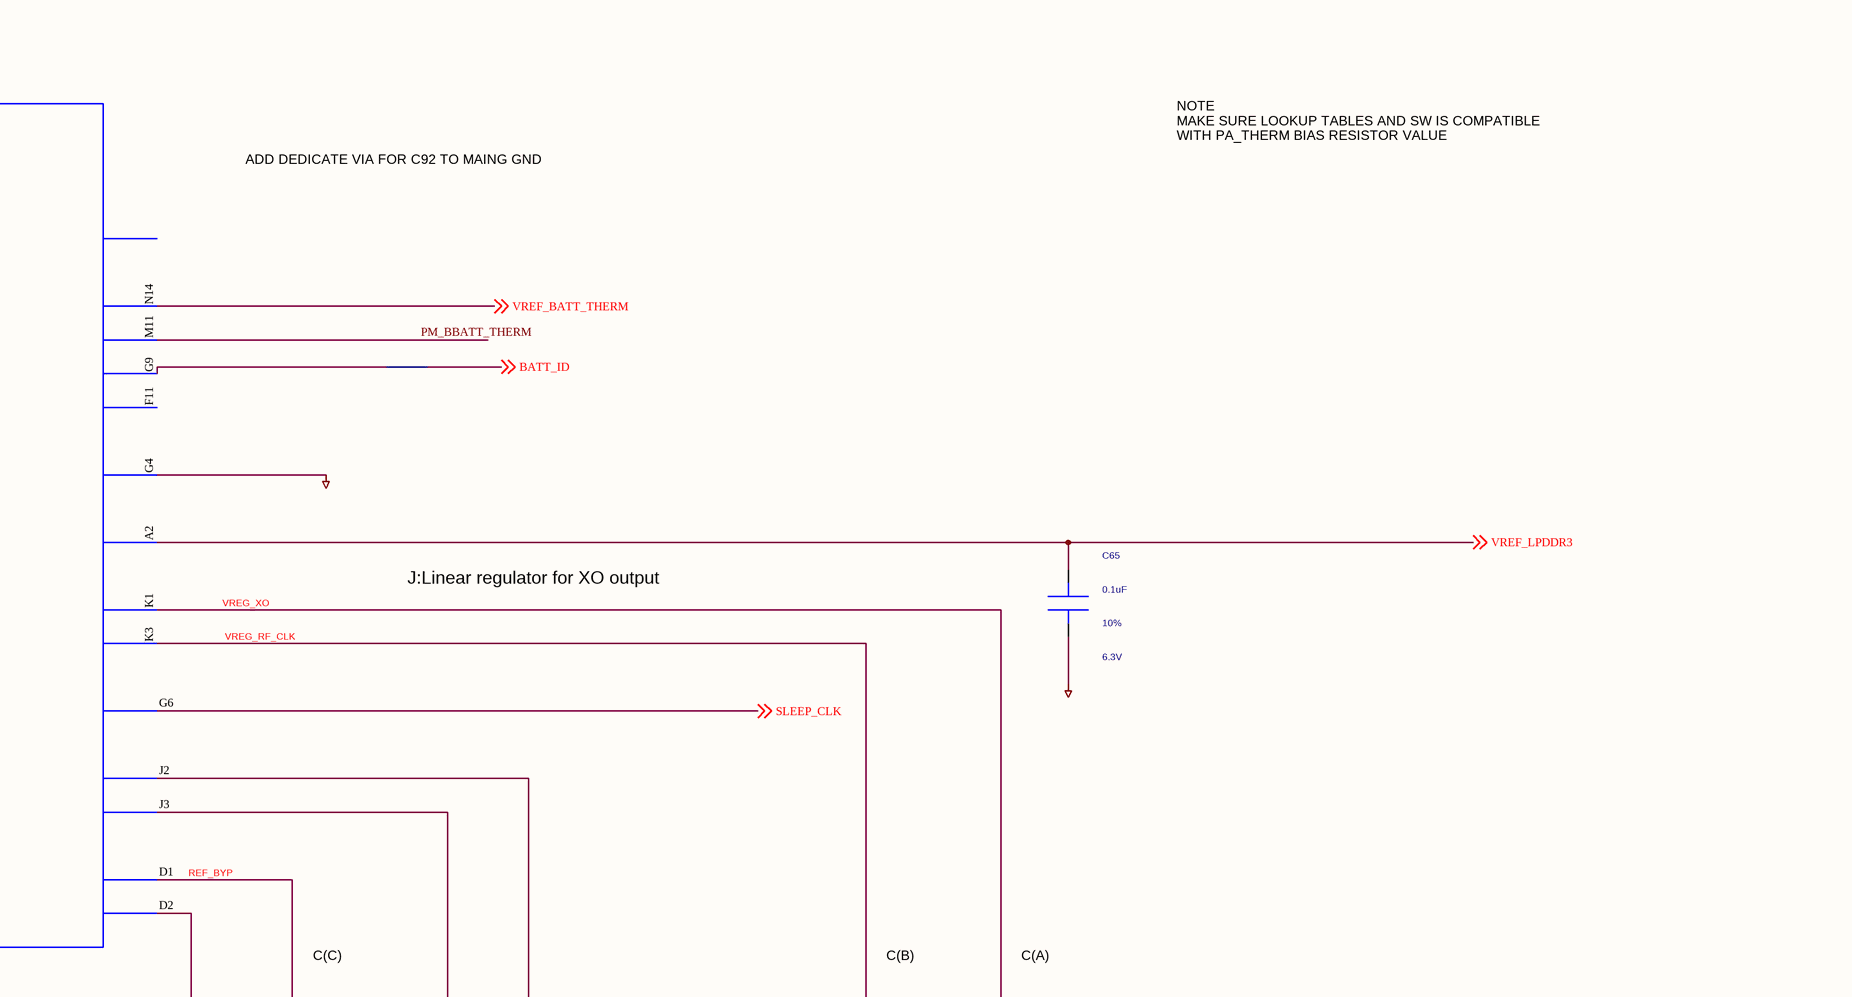
[diagram p36: 14 PM8916_CONTROL CLOCK.SchDoc, top right]
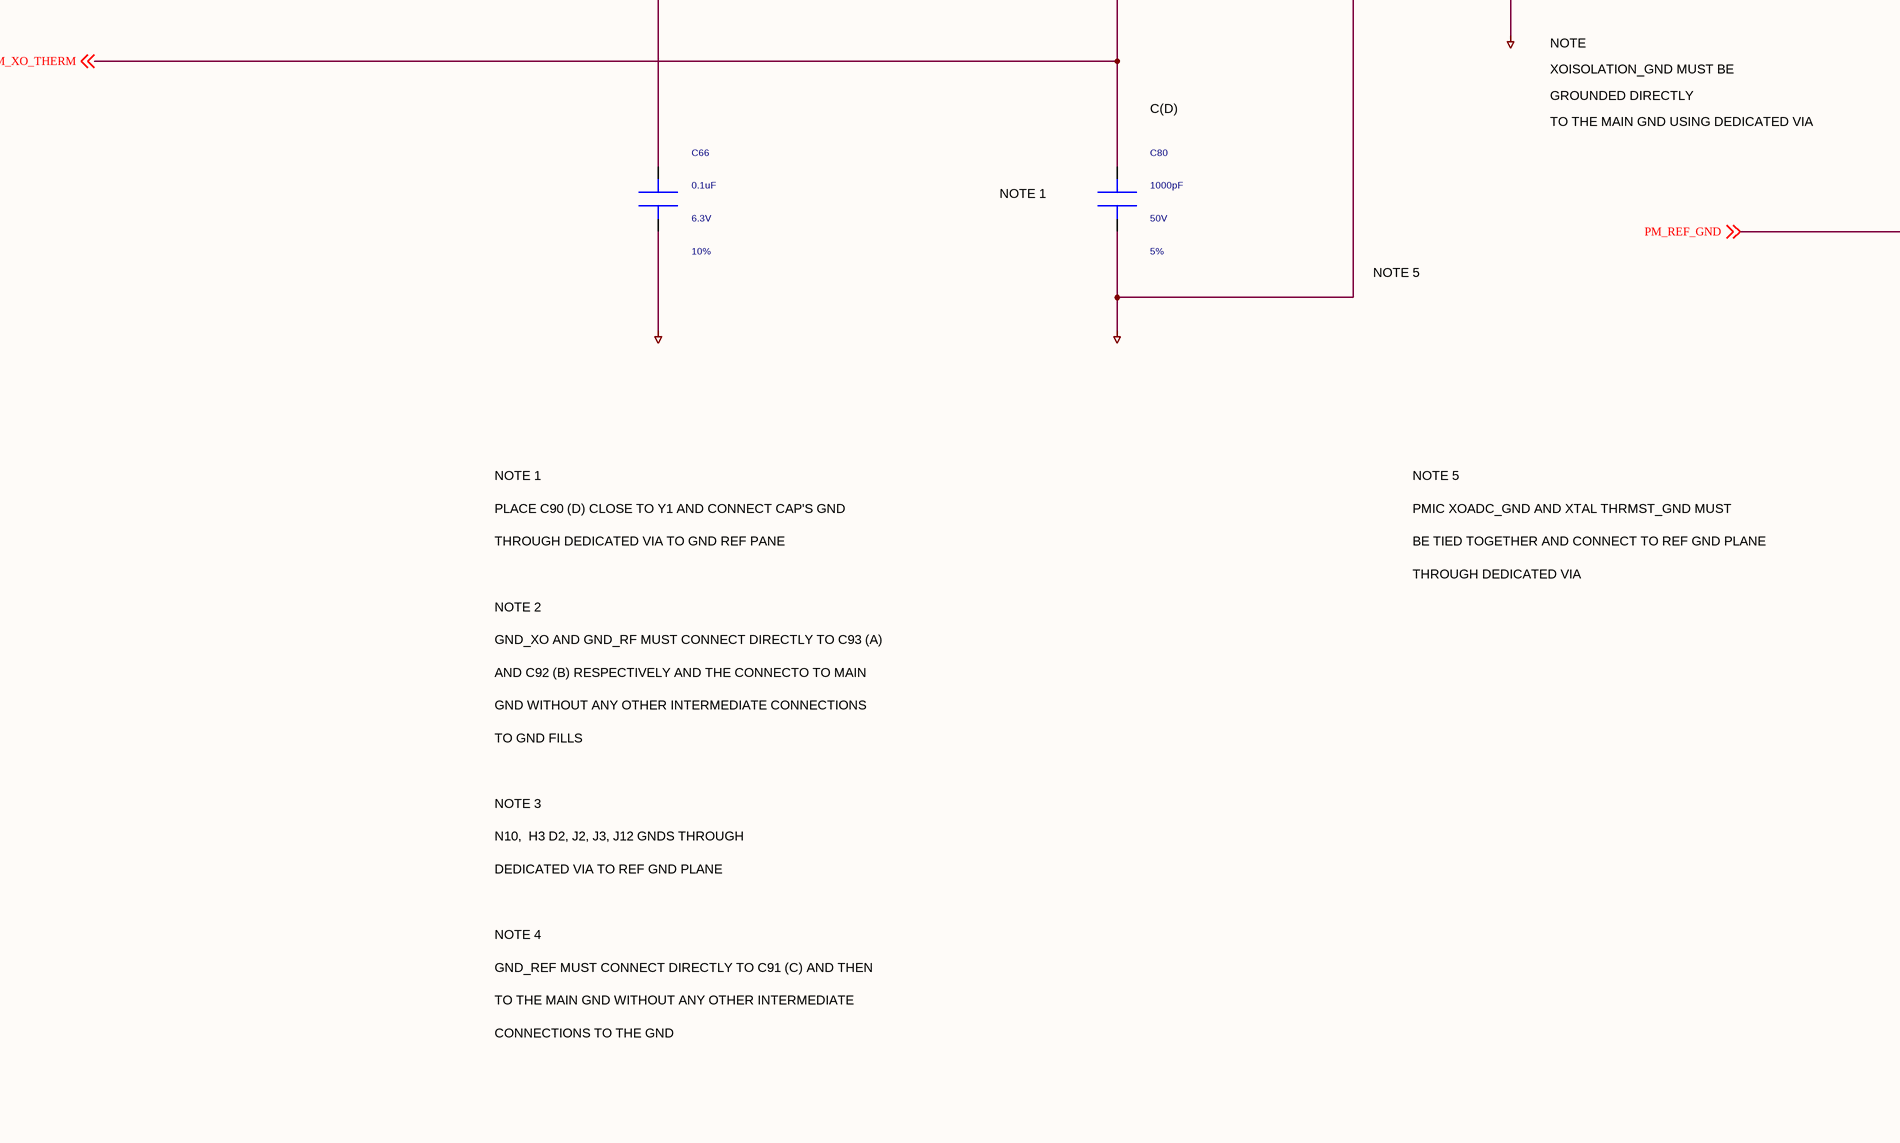
[diagram p37: 14 PM8916_CONTROL CLOCK.SchDoc, bottom left]
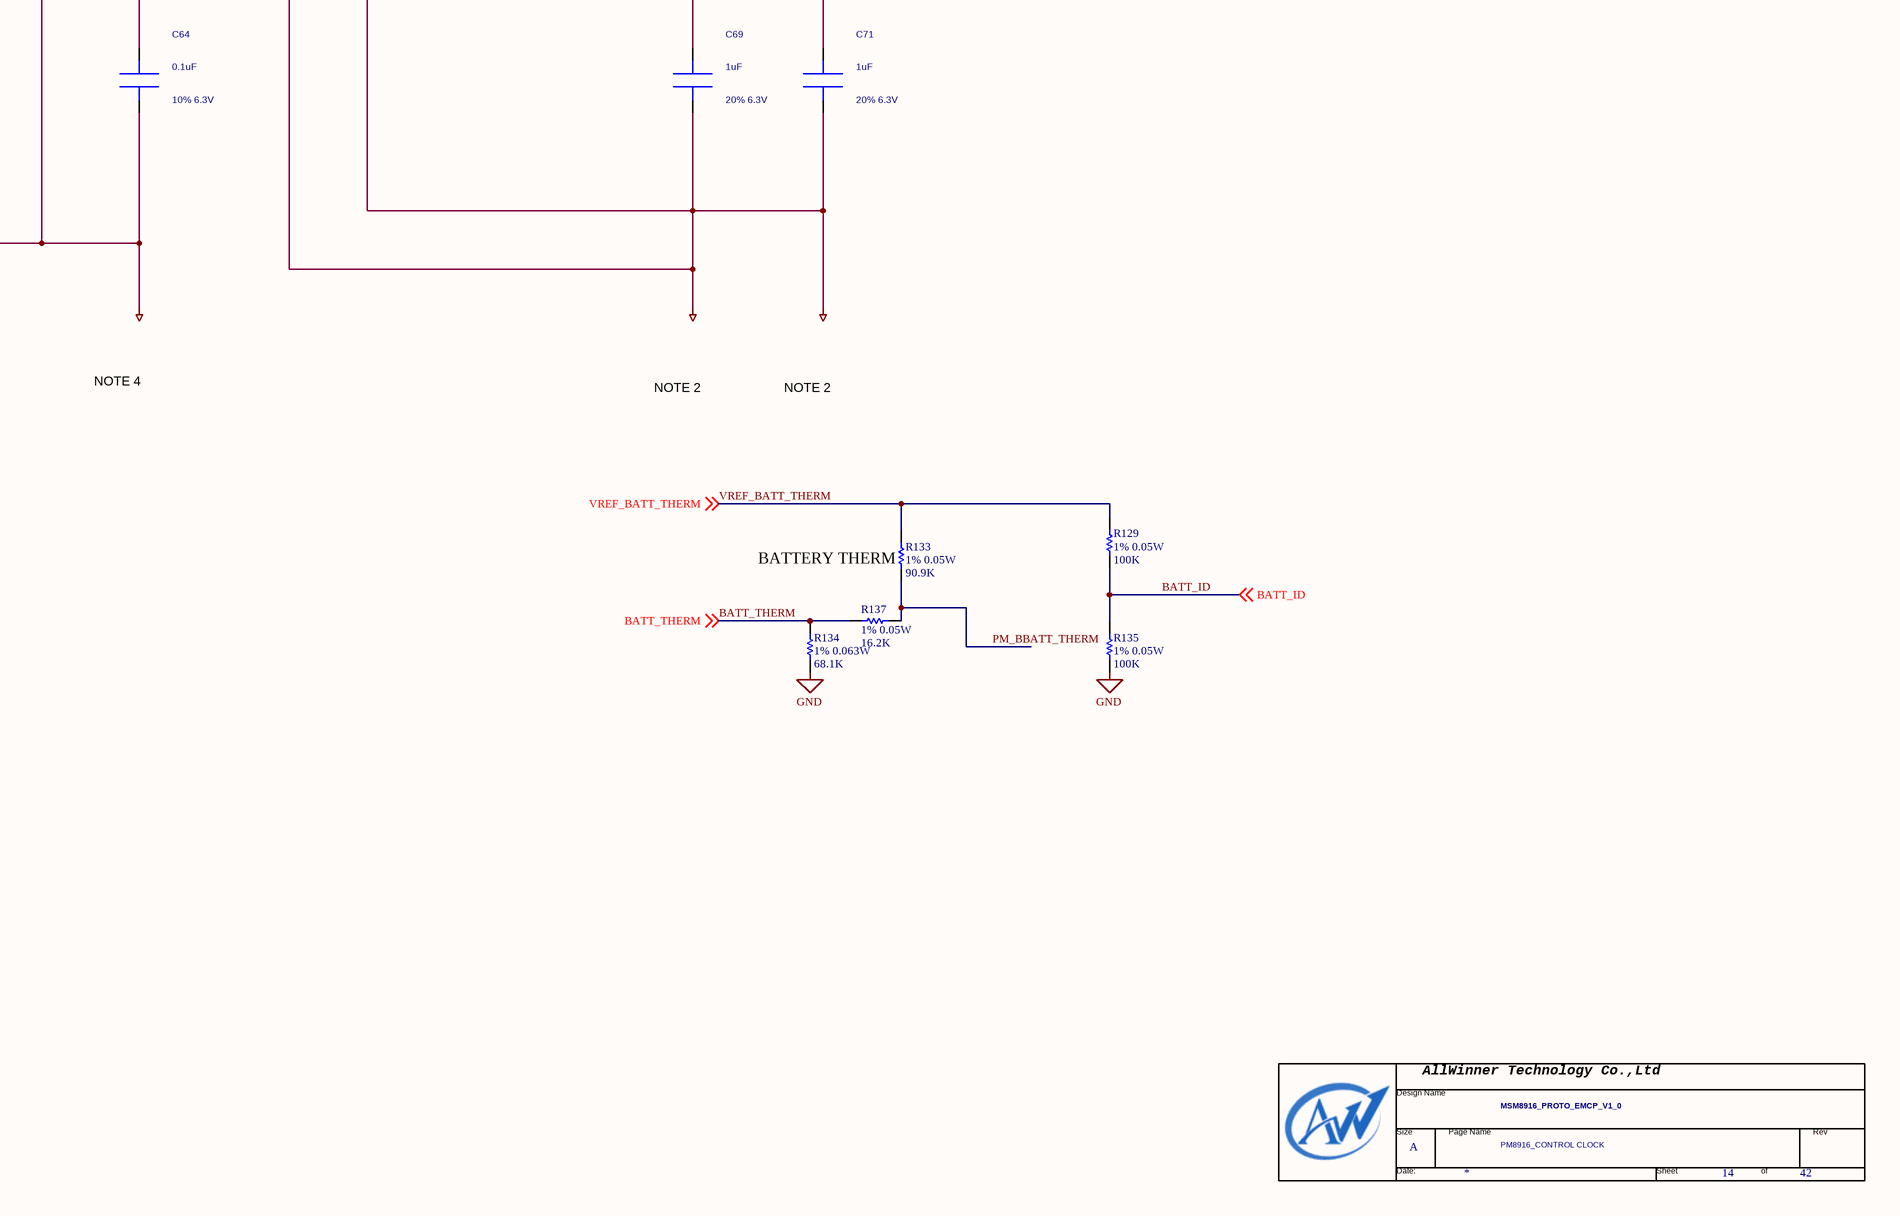
[diagram p38: 14 PM8916_CONTROL CLOCK.SchDoc, bottom right]

### Parts
(Parts that share a designator on the sheet are numbered #1, #2 ... from top to bottom, then left to right.)
*#7  Page Count: 42  Page Number: 14  Page Size: A  Title: MSM8916_PROTO_EMCP_V1_0  Doc: PM8916_CONTROL CLOCK  (hidden comment: TitleBlock0-AW)  (graphical)
C64  0.1uF  Tolerance: 10% 6.3V  [c0402]
C65  0.1uF  VOLT: 6.3V  Tolerance: 10%  [c0402]
C66  0.1uF  VOLT: 10%  Tolerance: 6.3V  [c0402]
C69  1uF  Tolerance: 20% 6.3V  [c0402]
C71  1uF  Tolerance: 20% 6.3V  [c0402]
C80  1000pF  VOLT: 5%  Tolerance: 50V  [c0402]
R25  10K  value 5% 0.05W  [r0402]
R28  100K  Tolerance: 1%  POWER: 0.05W  [c0402]
R104  0  POWER: 5% 0.05W  [c0402]
R129  1% 0.05W  value 100K  [r0402]
R133  1% 0.05W  value 90.9K  [r0402]
R134  1% 0.063W  value 68.1K  [r0402]
R135  1% 0.05W  value 100K  [r0402]
R137  1% 0.05W  value 16.2K  [r0402]
R166  0  value 5% 0.05W  [r0402]
U3  SYMNAME: GND  PART_ID: MFG_NO  BLOCKID: PROTO  [PM-8916-0-176NSP-TR-00-0]  (hidden comment: ASIC_PM8916)  (part B of 7)
Y1  PART_ID: MFG_NO  FREQ: 19.2MHZ  [c0402]  (hidden comment: crystal_4pin_thermistor_gnd)

### Nets
AVDD_BYP: U3.C2(AVDD_BYP)
DGND: C64.2(NEG) C65.2(NEG) C66.2(NEG) C69.2(NEG) C71.2(NEG) C80.2(NEG) R104.1(POS) U3.D2(REF_GND) U3.G4(TEST_EN) U3.H3(XOISOLATION_GND) U3.J2(GND_XO) U3.J3(GND_RF) U3.N10(XOADC_GND) Y1.2(THRMSTR_GND) ; off-sheet PM_REF_GND  [also labelled PM_REF_GND]
GND: R134.1 R135.1
VREG_L6_1P8: C66.1(POS) R28.1(POS) ; off-sheet VREG_L6_1P8
APQ_BBCLK1_EN: U3.E4(BBCLK1_EN) ; off-sheet APQ_BBCLK1_EN
APQ_PS_HOLD: R25.1 ; off-sheet APQ_PS_HOLD
APQ_RESIN_N: R166.1 ; off-sheet APQ_RESIN_N
BATT_ID: R129.1 R135.2 U3.G9(BAT_ID) ; off-sheet BATT_ID
BATT_THERM: R134.2 R137.1 ; off-sheet BATT_THERM
BBCLK1: U3.F2(BBCLK1) ; off-sheet BBCLK1
CBLPWR_N: R104.2(NEG) U3.L10(CBLPWR*)
CLK_IN_19M2_PM: U3.J1(XTAL19M2_IN) Y1.3(H2)
PHONE_ON_N: U3.K10(KYPDPWR*) ; off-sheet PHONE_ON_N
PM_BBATT_THERM: R133.1 R137.2 U3.M11(BAT_THERM)
PM_RESIN_N: U3.C3(RESIN*) ; off-sheet PM_RESIN_N
PM_XO_THERM: C80.1(POS) R28.2(NEG) U3.K2(XO_THERM) Y1.4(THRMSTR) ; off-sheet PM_XO_THERM
REF_BYP: C64.1(POS) U3.D1(REF_BYP)
RFCLK2: U3.L2(RFCLK2) ; off-sheet RFCLK2
SLEEP_CLK: U3.G6(SLEEP_CLK1) ; off-sheet SLEEP_CLK
SPMI_CLK: U3.A10(SPMI_CLK) ; off-sheet SPMI_CLK
SPMI_DATA: U3.B10(SPMI_DATA) ; off-sheet SPMI_DATA
VREF_BATT_THERM: R129.2 R133.2 U3.N14(VREF_BAT_THERM) ; off-sheet VREF_BATT_THERM
VREF_LPDDR3: C65.1(POS) U3.A2(VREF_LPDDR2) ; off-sheet VREF_LPDDR3  [project net EBIO_VREF]
VREG_RF_CLK: C69.1(POS) U3.K3(VREG_RF_CLK)
VREG_XO: C71.1(POS) U3.K1(VREG_XO)
XTAL_19M2_OUT: U3.H2(XTAL19M2_OUT) Y1.1(H1)
NetR25_2: R25.2 U3.G5(PS_HOLD)
NetR166_2: R166.2 U3.F5(PON_RESET*)

Not connected (* = marked no-connect by the designer): U3 F3(BBCLK2) F11(PA_THERM) L1(RFCLK1)

### Notes on the sheet
- PM8916 - CONTROL, CLOCK
- NOTE 5
- ADD DEDICATE VIA FOR C92 TO MAING GND
- NOTE
  MAKE SURE LOOKUP TABLES AND SW IS COMPATIBLE
  WITH PA_THERM BIAS RESISTOR VALUE
- BBCLK2
- J:Cable poweron detect input
- J:Linear regulator for XO output
- C(C)
- C(B)
- C(A)
- NOTE
- XOISOLATION_GND MUST BE
- GROUNDED DIRECTLY
- C(D)
- TO THE MAIN GND USING DEDICATED VIA
- NOTE 1
- NOTE 4
- NOTE 2
- THROUGH DEDICATED VIA TO GND REF PANE
- PLACE C90 (D) CLOSE TO Y1 AND CONNECT CAP'S GND
- BE TIED TOGETHER AND CONNECT TO REF GND PLANE
- PMIC XOADC_GND AND XTAL THRMST_GND MUST
- BATTERY THERM
- THROUGH DEDICATED VIA
- GND_XO AND GND_RF MUST CONNECT DIRECTLY TO C93 (A)
- AND C92 (B) RESPECTIVELY AND THE CONNECTO TO MAIN
- TO GND FILLS
- GND WITHOUT ANY OTHER INTERMEDIATE CONNECTIONS
- NOTE 3
- N10,  H3 D2, J2, J3, J12 GNDS THROUGH
- DEDICATED VIA TO REF GND PLANE
- TO THE MAIN GND WITHOUT ANY OTHER INTERMEDIATE
- GND_REF MUST CONNECT DIRECTLY TO C91 (C) AND THEN
- CONNECTIONS TO THE GND
- (in symbol TitleBlock0-AW) AllWinner Technology Co.,Ltd; Design Name; Size; Page Name; Rev; Date:; Sheet; of

### Library data of the parts
C64 C69 C71 = CAP: PART_NUMBER: MCN_NO; PART_ID: MFG_NO; OriginalSymbolOrigin: (-100,75); VOLT: ?V; CDS_LMAN_SYM_OUTLINE: -75,25,75,-25; SYMNAME: CAP; PACK_TYPE: ?
C65 C66 C80 = CAP: PART_NUMBER: MCN_NO; PART_ID: MFG_NO; OriginalSymbolOrigin: (-100,75); CDS_LMAN_SYM_OUTLINE: -75,25,75,-25; SYMNAME: CAP; PACK_TYPE: ?
R25 R129 R133-R135 R137 R166 = Res1: Resistor; Published: 8-Jun-2000; LatestRevisionDate: 17-Jul-2002; LatestRevisionNote: Re-released for DXP Platform.; PackageReference: AXIAL-0.3; Publisher: Altium Limited; PackageDescription: Axial Device, Thru-Hole; 2 Leads; 0.3 in Pin Spacing
R28 = RESISTOR_Dup3: PART_NUMBER: MCN_NO; PART_ID: MFG_NO; OriginalSymbolOrigin: (-200,50); CDS_LMAN_SYM_OUTLINE: -150,50,150,-50; SYMNAME: resistor; PACK_TYPE: ?
R104 = RESISTOR_Dup3: PART_NUMBER: MCN_NO; PART_ID: MFG_NO; OriginalSymbolOrigin: (-200,50); Tolerance: ?%; CDS_LMAN_SYM_OUTLINE: -150,50,150,-50; SYMNAME: resistor; PACK_TYPE: ?
U3 = ASIC_PM8916: PART_NUMBER: MCN_NO; OriginalSymbolOrigin: (-1050,1125); SPLIT_INST: TRUE; CDS_LMAN_SYM_OUTLINE: -850,1125,875,-1250; CDS_LMAN_SPLIT_NUMBER: 1 of 7; PACK_TYPE: ?
Y1 = CRYSTAL_4PIN_THERMISTOR_GND: PART_NUMBER: MCN_NO; OriginalSymbolOrigin: (-350,150); CDS_LMAN_SYM_OUTLINE: -300,125,300,-500; SYMNAME: crystal_4pin_thermistor_gnd; PACK_TYPE: ?
*#7 = TitleBlock0-AW: RevCode: ?; Page Create Date: March  8, 1995; Page Modify Date: *